# Altium project ECU rev B.PrjPcb (part 1 of 2)
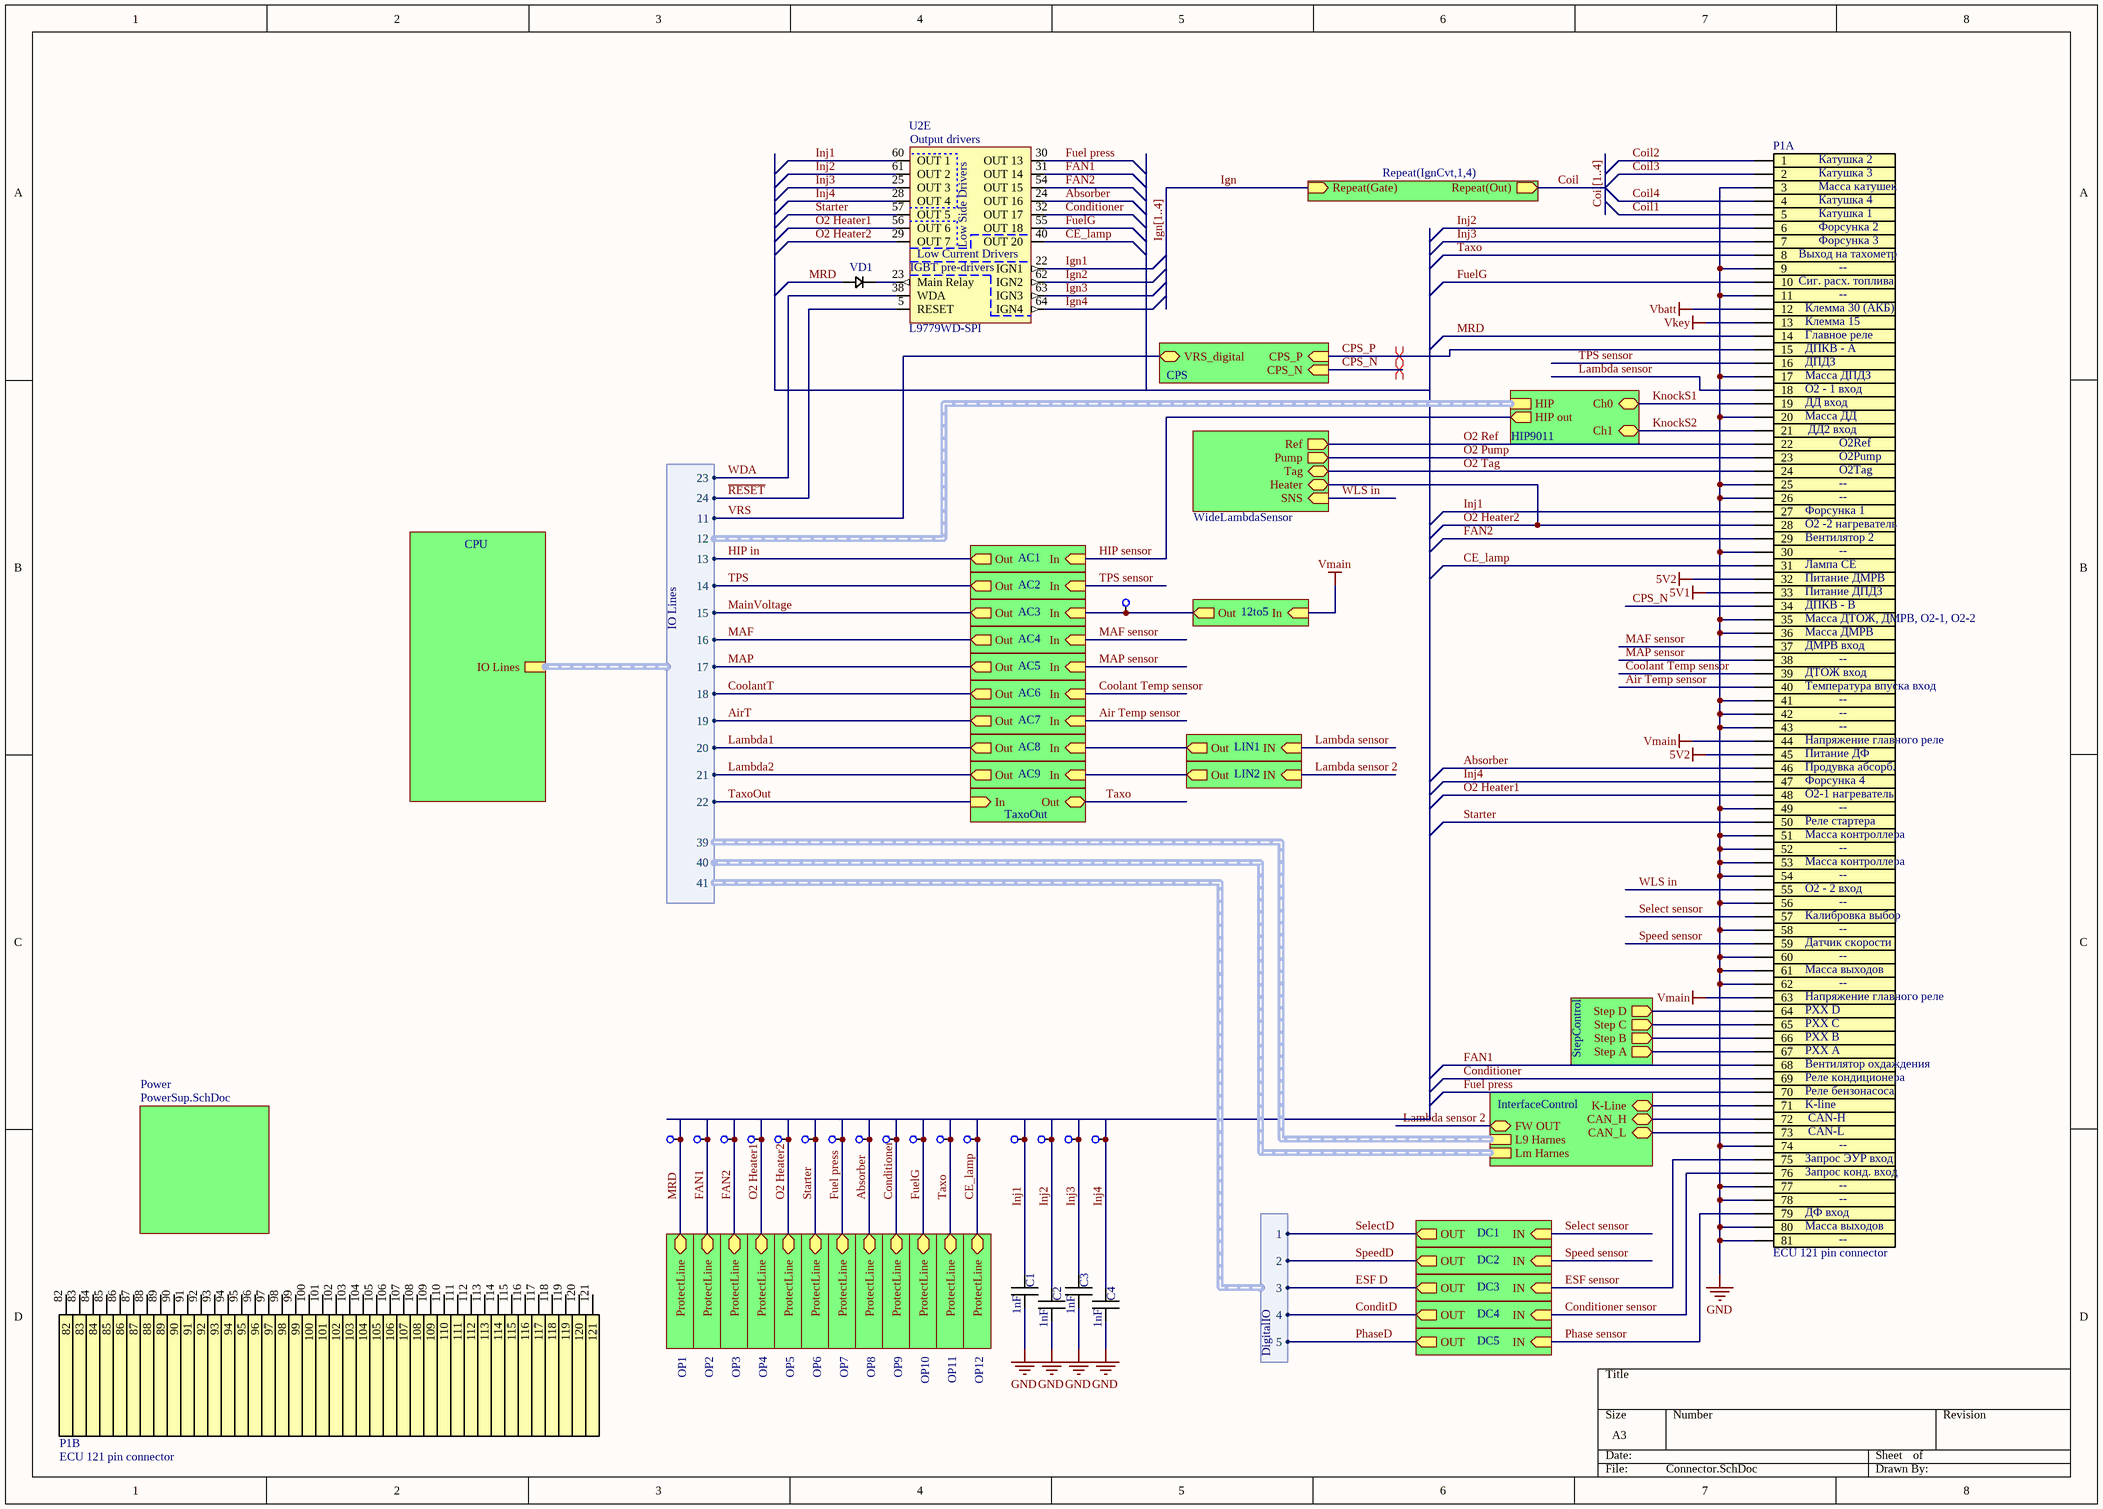
[diagram p0: Connector.SchDoc]
17 sheets, 577 parts. Net scope: hierarchical (ports join the sheet entries above them; power ports are global).
Board file: ECU rev B pcb.PcbDoc
Sheets:
  Connector.SchDoc
    IgnCvt1 = IgnMOSFET.SchDoc
    IgnCvt2 = IgnMOSFET.SchDoc
    IgnCvt3 = IgnMOSFET.SchDoc
    IgnCvt4 = IgnMOSFET.SchDoc
    StepControl = StepDrive.SchDoc
    InterfaceControl = Interface.SchDoc
    OP1 = OutProtect.SchDoc
    OP2 = OutProtect.SchDoc
    OP3 = OutProtect.SchDoc
    OP4 = OutProtect.SchDoc
    OP5 = OutProtect.SchDoc
    OP6 = OutProtect.SchDoc
    OP7 = OutProtect.SchDoc
    OP8 = OutProtect.SchDoc
    OP9 = OutProtect.SchDoc
    OP10 = OutProtect.SchDoc
    OP11 = OutProtect.SchDoc
    OP12 = OutProtect.SchDoc
    Power = PowerSup.SchDoc
    CPS = VRS.SchDoc
    WideLambdaSensor = LambdaWide.SchDoc
    DC1 = DigitalConverter.SchDoc
    DC2 = DigitalConverter.SchDoc
    DC3 = DigitalConverter.SchDoc
    DC4 = DigitalConverter.SchDoc
    DC5 = DigitalConverter.SchDoc
    HIP9011 = HIP9011.SchDoc
    AC1 = AnalogIn.SchDoc
    AC2 = AnalogIn.SchDoc
    AC3 = AnalogIn.SchDoc
    AC4 = AnalogIn.SchDoc
    AC5 = AnalogIn.SchDoc
    AC6 = AnalogIn.SchDoc
    AC7 = AnalogIn.SchDoc
    12to5 = Convert12to5.SchDoc
    AC8 = AnalogIn.SchDoc
    AC9 = AnalogIn.SchDoc
    LIN1 = LambdaIn.SchDoc
    LIN2 = LambdaIn.SchDoc
    TaxoOut = TaxoOut.SchDoc
    CPU = CPU_A.SchDoc
      ExtRam = ExternalRAM.SchDoc
      ExtIO = ExternalIO.SchDoc

## Sheet Connector.SchDoc
size A3

### Parts
C1  1nF  [SMD 0603]
C2  1nF  [SMD 0603]
C3  1nF  [SMD 0603]
C4  1nF  [SMD 0603]
P1  ECU 121 pin connector  [1241434-1]  (parts A,B of 2)  (no BOM)
TP1  TestPoint  [TESTPOINT]  (value not drawn)
TP2  TestPoint  [TESTPOINT]  (value not drawn)
TP3  TestPoint  [TESTPOINT]  (value not drawn)
TP4  TestPoint  [TESTPOINT]  (value not drawn)
TP5  TestPoint  [TESTPOINT]  (value not drawn)
TP6  TestPoint  [TESTPOINT]  (value not drawn)
TP7  TestPoint  [TESTPOINT]  (value not drawn)
TP8  TestPoint  [TESTPOINT]  (value not drawn)
TP9  TestPoint  [TESTPOINT]  (value not drawn)
TP10  TestPoint  [TESTPOINT]  (value not drawn)
TP11  TestPoint  [TESTPOINT]  (value not drawn)
TP12  TestPoint  [TESTPOINT]  (value not drawn)
TP13  TestPoint  [TESTPOINT]  (value not drawn)
TP14  TestPoint  [TESTPOINT]  (value not drawn)
TP15  TestPoint  [TESTPOINT]  (value not drawn)
TP16  TestPoint  [TESTPOINT]  (value not drawn)
TP17  TestPoint  [TESTPOINT]  (value not drawn)
U2  L9779WD-SPI  [HiQUAD-64]  (part E of 6)
VD1  Diode  [DO-214AC]  (value not drawn)

### Sub-sheets
12to5 = Convert12to5.SchDoc: In (in), Out (out)
AC1 = AnalogIn.SchDoc: Out (out), In (in)
AC2 = AnalogIn.SchDoc: Out (out), In (in)
AC3 = AnalogIn.SchDoc: Out (out), In (in)
AC4 = AnalogIn.SchDoc: Out (out), In (in)
AC5 = AnalogIn.SchDoc: Out (out), In (in)
AC6 = AnalogIn.SchDoc: Out (out), In (in)
AC7 = AnalogIn.SchDoc: Out (out), In (in)
AC8 = AnalogIn.SchDoc: Out (out), In (in)
AC9 = AnalogIn.SchDoc: Out (out), In (in)
CPS = VRS.SchDoc: CPS_P (in), VRS_digital (bidir), CPS_N (in)
CPU = CPU_A.SchDoc: IO Lines (harness IO Lines)
DC1 = DigitalConverter.SchDoc: IN (in), OUT (out)
DC2 = DigitalConverter.SchDoc: IN (in), OUT (out)
DC3 = DigitalConverter.SchDoc: IN (in), OUT (out)
DC4 = DigitalConverter.SchDoc: IN (in), OUT (out)
DC5 = DigitalConverter.SchDoc: IN (in), OUT (out)
HIP9011 = HIP9011.SchDoc: HIP (harness HIP), Ch0 (bidir), Ch1 (bidir), HIP out (out)
InterfaceControl = Interface.SchDoc: CAN_L (bidir), CAN_H (bidir), K-Line (bidir), FW OUT (bidir), L9 Harnes (harness L9 Harnes), Lm Harnes (harness Lm Harnes)
LIN1 = LambdaIn.SchDoc: Out (out), IN (in)
LIN2 = LambdaIn.SchDoc: Out (out), IN (in)
OP1 = OutProtect.SchDoc: ProtectLine (bidir)
OP2 = OutProtect.SchDoc: ProtectLine (bidir)
OP3 = OutProtect.SchDoc: ProtectLine (bidir)
OP4 = OutProtect.SchDoc: ProtectLine (bidir)
OP5 = OutProtect.SchDoc: ProtectLine (bidir)
OP6 = OutProtect.SchDoc: ProtectLine (bidir)
OP7 = OutProtect.SchDoc: ProtectLine (bidir)
OP8 = OutProtect.SchDoc: ProtectLine (bidir)
OP9 = OutProtect.SchDoc: ProtectLine (bidir)
OP10 = OutProtect.SchDoc: ProtectLine (bidir)
OP11 = OutProtect.SchDoc: ProtectLine (bidir)
OP12 = OutProtect.SchDoc: ProtectLine (bidir)
Power = PowerSup.SchDoc: no entries
Repeat(IgnCvt,1,4) = IgnMOSFET.SchDoc: Repeat(Gate) (in), Repeat(Out) (out)
StepControl = StepDrive.SchDoc: Step C (out), Step D (out), Step B (out), Step A (out)
TaxoOut = TaxoOut.SchDoc: Out (bidir), In (in)
WideLambdaSensor = LambdaWide.SchDoc: SNS (in), Heater (bidir), Ref (out), Pump (out), Tag (bidir)

### Harnesses
DigitalIO: 1, 2, 3, 4, 5
IO Lines: 11, 12, 13, 14, 15, 16, 17, 18, 19, 20, 21, 22, 23, 24, 39, 40, 41

### Nets
5V1: P1.33
5V2: P1.32 P1.45
GND: C1.1 C2.1 C3.1 C4.1 P1.3 P1.9 P1.11 P1.17 P1.20 P1.25 P1.26 P1.30 P1.35 P1.36 P1.41 P1.42 P1.43 P1.49 P1.51 P1.52 P1.53 P1.54 P1.56 P1.58 P1.60 P1.61 P1.62 P1.74 P1.77 P1.78 P1.80 P1.81
Vbatt: P1.12
Vkey: P1.13
Vmain: P1.44 P1.63 ; sheet 12to5/In
~{RESET}: U2.5(RESET) ; sheet CPU/IO Lines.24
Absorber: P1.46 TP8.0 U2.24(OUT_16) ; sheet OP8/ProtectLine
Air Temp sensor: P1.40 ; sheet AC7/In
AirT: sheet AC7/Out, sheet CPU/IO Lines.19
CAN_H: P1.72 ; sheet InterfaceControl/CAN_H
CAN_L: P1.73 ; sheet InterfaceControl/CAN_L
CE_lamp: P1.31 TP12.0 U2.40(OUT_20) ; sheet OP12/ProtectLine
Coil: sheet Repeat(IgnCvt,1,4)/Repeat(Out)
Coil1: P1.5
Coil2: P1.1
Coil3: P1.2
Coil4: P1.4
ConditD: sheet DC4/OUT, harness DigitalIO.4
Conditioner: P1.69 TP9.0 U2.32(OUT_17) ; sheet OP9/ProtectLine
Conditioner sensor: P1.76 ; sheet DC4/IN
Coolant Temp sensor: P1.39 ; sheet AC6/In
CoolantT: sheet AC6/Out, sheet CPU/IO Lines.18
CPS_N: P1.34 ; sheet CPS/CPS_N
CPS_P: P1.15 ; sheet CPS/CPS_P
ESF D: sheet DC3/OUT, harness DigitalIO.3
ESF sensor: P1.75 ; sheet DC3/IN
FAN1: P1.68 TP2.0 U2.31(OUT_14) ; sheet OP2/ProtectLine
FAN2: P1.29 TP3.0 U2.54(OUT_15) ; sheet OP3/ProtectLine
Fuel press: P1.70 TP7.0 U2.30(OUT_13) ; sheet OP7/ProtectLine
FuelG: P1.10 TP10.0 U2.55(OUT_18) ; sheet OP10/ProtectLine
HIP in: sheet AC1/Out, sheet CPU/IO Lines.13
HIP sensor: sheet HIP9011/HIP out, sheet AC1/In
Ign: sheet Repeat(IgnCvt,1,4)/Repeat(Gate)
Ign1: U2.22(IGN1)
Ign2: U2.62(IGN2)
Ign3: U2.63(IGN3)
Ign4: U2.64(IGN4)
Inj1: C1.2 P1.27 TP13.0 U2.60(OUT_1)
Inj2: C2.2 P1.6 TP14.0 U2.61(OUT_2)
Inj3: C3.2 P1.7 TP15.0 U2.25(OUT_3)
Inj4: C4.2 P1.47 TP16.0 U2.28(OUT_4)
K-line: P1.71 ; sheet InterfaceControl/K-Line
KnockS1: P1.19 ; sheet HIP9011/Ch0
KnockS2: P1.21 ; sheet HIP9011/Ch1
Lambda1: sheet AC8/Out, sheet CPU/IO Lines.20
Lambda2: sheet AC9/Out, sheet CPU/IO Lines.21
Lambda sensor: P1.18 ; sheet LIN1/IN
Lambda sensor 2: sheet InterfaceControl/FW OUT, sheet LIN2/IN
MAF: sheet AC4/Out, sheet CPU/IO Lines.16
MAF sensor: P1.37 ; sheet AC4/In
MainVoltage: sheet AC3/Out, sheet CPU/IO Lines.15
MAP: sheet AC5/Out, sheet CPU/IO Lines.17
MAP sensor: P1.38 ; sheet AC5/In
MRD: P1.14 TP1.0 VD1.0 ; sheet OP1/ProtectLine
O2 Heater1: P1.48 TP4.0 U2.56(OUT_6) ; sheet OP4/ProtectLine
O2 Heater2: P1.28 TP5.0 U2.29(OUT_7) ; sheet OP5/ProtectLine, sheet WideLambdaSensor/Heater
O2 Pump: P1.23 ; sheet WideLambdaSensor/Pump
O2 Ref: P1.22 ; sheet WideLambdaSensor/Ref
O2 Tag: P1.24 ; sheet WideLambdaSensor/Tag
Phase sensor: P1.79 ; sheet DC5/IN
PhaseD: sheet DC5/OUT, harness DigitalIO.5
Select sensor: P1.57 ; sheet DC1/IN
SelectD: sheet DC1/OUT, harness DigitalIO.1
Speed sensor: P1.59 ; sheet DC2/IN
SpeedD: sheet DC2/OUT, harness DigitalIO.2
Starter: P1.50 TP6.0 U2.57(OUT_5) ; sheet OP6/ProtectLine
Step phase A: P1.67 ; sheet StepControl/Step A
Step phase B: P1.66 ; sheet StepControl/Step B
Step phase C: P1.65 ; sheet StepControl/Step C
Step phase D: P1.64 ; sheet StepControl/Step D
Taxo: P1.8 TP11.0 ; sheet OP11/ProtectLine, sheet TaxoOut/Out
TaxoOut: sheet TaxoOut/In, sheet CPU/IO Lines.22
TPS: sheet AC2/Out, sheet CPU/IO Lines.14
TPS sensor: P1.16 ; sheet AC2/In
VRS: sheet CPS/VRS_digital, sheet CPU/IO Lines.11
WDA: U2.38(WDA) ; sheet CPU/IO Lines.23
WLS in: P1.55 ; sheet WideLambdaSensor/SNS
NetC87_AC3_2: TP17.0 ; sheet AC3/In, sheet 12to5/Out
NetC87_AC8_2: sheet AC8/In, sheet LIN1/Out
NetC87_AC9_2: sheet AC9/In, sheet LIN2/Out
NetU2_23: U2.23(Main_Relay) VD1.1

Not connected (* = marked no-connect by the designer): P1 82 83 84 85 86 87 88 89 90 91 92 93 94 95 96 97 98 99 100 101 102 103 104 105 106 107 108 109 110 111 112 113 114 115 116 117 118 119 120 121

### Buses and harness runs
bus Coil[1..4]
bus Ign[1..4]

### Layout directives
differential pair: CPS_N, CPS_P

### Notes on the sheet
- (near P1) Катушка 2
- (near P1) Катушка 3
- (near P1) Катушка 1
- (near P1) Катушка 4
- (near P1) Масса катушек
- (near P1) Форсунка 2
- (near P1) Форсунка 3
- (near P1) Выход на тахометр
- (near P1) Сиг. расх. топлива
- (near P1) Клемма 30 (АКБ)
- --
- (near P1) Клемма 15
- (near P1) Главное реле
- (near P1) ДПКВ - А
- (near P1) Масса ДПДЗ
- (near P1) ДПДЗ
- (near P1) О2 - 1 вход
- (near P1) ДД вход
- (near P1) Масса ДД
- (near P1) ДД2 вход
- O2Ref
- (near P1) Форсунка 1
- O2Pump
- O2Tag
- (near P1) О2 -2 нагреватель
- (near P1) Вентилятор 2
- (near P1) Лампа CE
- (near P1) Питание ДМРВ
- (near P1) Питание ДПДЗ
- (near P1) ДПКВ - В
- (near P1) Масса ДТОЖ, ДМРВ, О2-1, О2-2
- (near P1) Масса ДМРВ
- (near P1) ДМРВ вход
- (near P1) ДТОЖ вход
- (near P1) Температура впуска вход
- (near P1) Форсунка 4
- (near P1) Продувка абсорб.
- (near P1) Питание ДФ
- (near P1) Напряжение главного реле
- (near P1) О2-1 нагреватель
- (near P1) Реле стартера
- (near P1) Масса контроллера
- (near P1) О2 - 2 вход
- (near P1) Калибровка выбор
- (near P1) Датчик скорости
- (near P1) Масса выходов
- (near P1) РХХ А
- (near P1) РХХ B
- (near P1) РХХ C
- (near P1) РХХ D
- (near P1) Вентилятор охдаждения
- (near P1) Реле кондиционера
- (near P1) Реле бензонасоса
- (near P1) K-line
- (near P1) CAN-H
- (near P1) Запрос ЭУР вход
- (near P1) Запрос конд. вход
- (near P1) CAN-L
- (near P1) ДФ вход
- (in symbol L9779WD-SPI, part E) Output drivers; Low Side Drivers; Low Current Drivers; IGBT pre-drivers

### Library data of the parts
C1-C4 = Capasitor: CC0603KRX7R9BB102; Value: 1nF
P1 = 1241434-1
U2 = L9779WD-SPI: Multifunction IC for engine management system
VD1 = Diode: STTH2R02A

## Sheet IgnMOSFET.SchDoc
size A4
Used 4 times, as channels IgnCvt1, IgnCvt2, IgnCvt3, IgnCvt4. Parts and nets are listed once, with the designators drawn on the sheet.
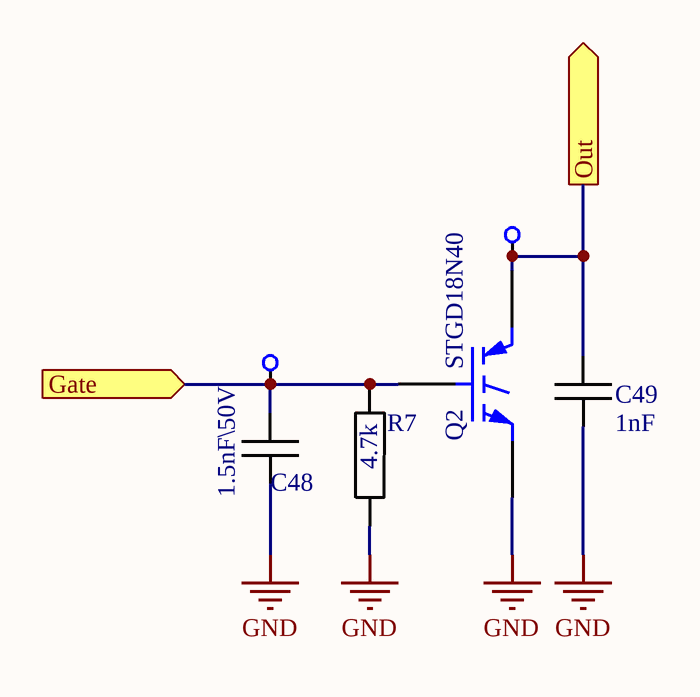
[diagram p1: IgnMOSFET.SchDoc]

### Parts
C48  1.5nF\50V  [SMD 0603]
C49  1nF  [SMD 0603]
Q2  STGD18N40  [DPAK228P991X238-3M]
R7  4.7k  [SMD 0603]
TP29  TestPoint  [TESTPOINT]  (value not drawn)
TP30  TestPoint  [TESTPOINT]  (value not drawn)

### Ports
Gate (in), Out (out)

### Nets
GND: C48.1 C49.1 Q2.3(E) R7.1
Gate: C48.2 Q2.1(G) R7.2 TP29.0 ; port Gate
Out: C49.2 Q2.4(C) TP30.0 ; port Out

### Channels
IgnCvt1: designators end in _IgnCvt1; ports Gate=Ign1 Out=Coil1
IgnCvt2: designators end in _IgnCvt2; ports Gate=Ign2 Out=Coil2
IgnCvt3: designators end in _IgnCvt3; ports Gate=Ign3 Out=Coil3
IgnCvt4: designators end in _IgnCvt4; ports Gate=Ign4 Out=Coil4

### Library data of the parts
C48 = Capasitor: CC0603KRX7R9BB152; Value: 1.5nF\50V
C49 = Capasitor: CC0603KRX7R9BB102; Value: 1nF
Q2 = STGD18N40: IGBT Automotive-grade 390 V internally clamped  ESCIS 180 mJ; ComponentLink1Description: Datasheet; ComponentLink1URL: https://my.st.com/resource/en/datasheet/stgd18n40lz.pdf
R7 = Resistor: RC0603FR-074K7L; Value: 4.7k

## Sheet StepDrive.SchDoc
size A4; Organization: Altium Limited; Address1: L3, 12a Rodborough Rd; Address2: Frenchs Forest; Address3: NSW; Address4: Australia 2086
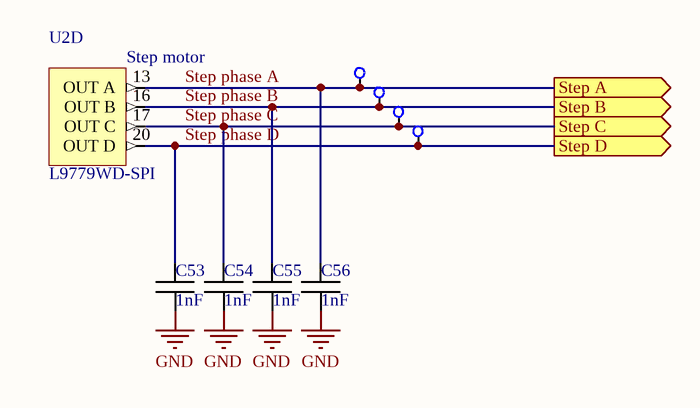
[diagram p2: StepDrive.SchDoc]

### Parts
C53  1nF  [SMD 0603]
C54  1nF  [SMD 0603]
C55  1nF  [SMD 0603]
C56  1nF  [SMD 0603]
TP34  TestPoint  [TESTPOINT]  (value not drawn)
TP35  TestPoint  [TESTPOINT]  (value not drawn)
TP36  TestPoint  [TESTPOINT]  (value not drawn)
TP37  TestPoint  [TESTPOINT]  (value not drawn)
U2  L9779WD-SPI  [HiQUAD-64]  (part D of 6)

### Ports
Step A (out), Step B (out), Step C (out), Step D (out)

### Nets
GND: C53.1 C54.1 C55.1 C56.1
Step phase A: C56.2 TP34.0 U2.13(OUT_A) ; port Step A
Step phase B: C55.2 TP35.0 U2.16(OUT_B) ; port Step B
Step phase C: C54.2 TP36.0 U2.17(OUT_C) ; port Step C
Step phase D: C53.2 TP37.0 U2.20(OUT_D) ; port Step D

### Notes on the sheet
- Title
- Size:
- Date:
- A4
- Number:
- Time:
- Revision:
- Sheet
- of
- File:
- (in symbol L9779WD-SPI, part D) Step motor

### Library data of the parts
C53-C56 = Capasitor: CC0603KRX7R9BB102; Value: 1nF
U2 = L9779WD-SPI: as U2 on sheet Connector

## Sheet Interface.SchDoc
size A4; Organization: Altium Limited; Address1: L3, 12a Rodborough Rd; Address2: Frenchs Forest; Address3: NSW; Address4: Australia 2086
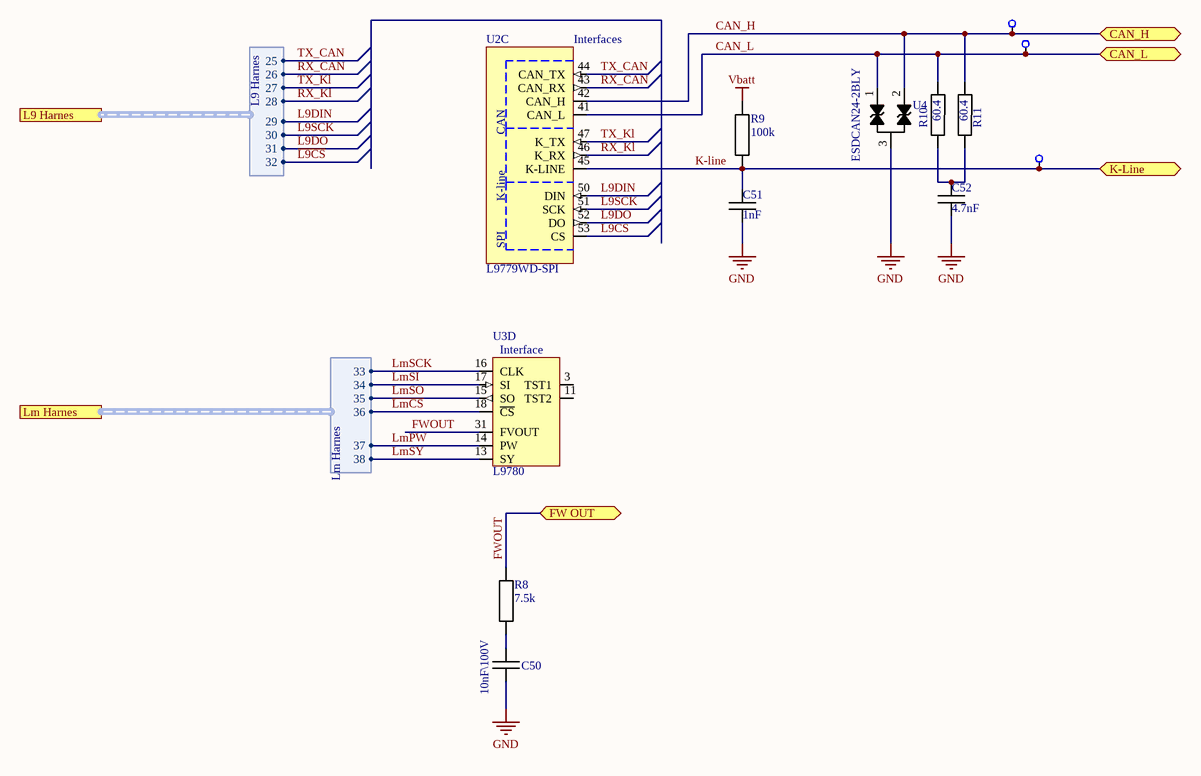
[diagram p3: Interface.SchDoc]

### Parts
C50  10nF\100V  [SMD 0603]
C51  1nF  [SMD 0603]
C52  4.7nF  [SMD 0603]
R8  7.5k  [SMD 0603]
R9  100k  [SMD 0603]
R10  60.4  [SMD 0603]
R11  60.4  [SMD 0603]
TP31  TestPoint  [TESTPOINT]  (value not drawn)
TP32  TestPoint  [TESTPOINT]  (value not drawn)
TP33  TestPoint  [TESTPOINT]  (value not drawn)
U2  L9779WD-SPI  [HiQUAD-64]  (part C of 6)
U3  L9780  [LQFP-48N]  (part D of 4)
U4  ESDCAN24-2BLY  [SOT23]

### Ports
CAN_H (bidir), CAN_L (bidir), FW OUT (bidir), K-Line (bidir), L9 Harnes (harness L9 Harnes), Lm Harnes (harness Lm Harnes)

### Harnesses
L9 Harnes: 25, 26, 27, 28, 29, 30, 31, 32
Lm Harnes: 33, 34, 35, 36, 37, 38

### Nets
GND: C50.1 C51.1 C52.1 U4.3
Vbatt: R9.2
~{L9CS}: U2.53(CS) ; port L9 Harnes.32
~{LmCS}: U3.18(~{CS}) ; port Lm Harnes.36
CAN_H: R11.2 TP31.0 U2.42(CAN_H) U4.2 ; port CAN_H
CAN_L: R10.2 TP32.0 U2.41(CAN_L) U4.1 ; port CAN_L
FWOUT: R8.1 U3.31(FVOUT) ; port FW OUT  [project net Lambda sensor 2]
K-line: C51.2 R9.1 TP33.0 U2.45(K-LINE) ; port K-Line
L9DIN: U2.50(DIN) ; port L9 Harnes.29
L9DO: U2.52(DO) ; port L9 Harnes.31
L9SCK: U2.51(SCK) ; port L9 Harnes.30
LmPW: U3.14(PW) ; port Lm Harnes.37
LmSCK: U3.16(CLK) ; port Lm Harnes.33
LmSI: U3.17(SI) ; port Lm Harnes.34
LmSO: U3.15(SO) ; port Lm Harnes.35
LmSY: U3.13(SY) ; port Lm Harnes.38
RX_CAN: U2.43(CAN_RX) ; port L9 Harnes.26
RX_Kl: U2.46(K_RX) ; port L9 Harnes.28
TX_CAN: U2.44(CAN_TX) ; port L9 Harnes.25
TX_Kl: U2.47(K_TX) ; port L9 Harnes.27
NetC50_2: C50.2 R8.2
NetC52_2: C52.2 R10.1 R11.1

Not connected (* = marked no-connect by the designer): U3 3(TST1) 11(TST2)

### Notes on the sheet
- Title
- Size:
- Date:
- A4
- Number:
- Time:
- Revision:
- Sheet
- of
- File:
- (in symbol L9779WD-SPI, part C) Interfaces; CAN; K-line; SPI
- (in symbol L9780, part D) Interface

### Library data of the parts
C50 = Capasitor: CC0603KRX7R0BB103; Value: 10nF\100V
C51 = Capasitor: CC0603KRX7R9BB102; Value: 1nF
C52 = Capasitor: CC0603KRX7R9BB472; Value: 4.7nF
R8 = Resistor: RC0603FR-077K5L; Value: 7.5k
R9 = Resistor: RT0603BRD07100KL; Value: 100k
R10 R11 = Resistor: RC0603FR-0760R4L; Value: 60.4
U2 = L9779WD-SPI: as U2 on sheet Connector
U3 = L9780: Wide range air fuel sensor control interface
U4 = ESDCANxx-2BLY

## Sheet OutProtect.SchDoc
size A4; Organization: Altium Limited; Address1: L3, 12a Rodborough Rd; Address2: Frenchs Forest; Address3: NSW; Address4: Australia 2086
Used 12 times, as channels OP1, OP2, OP3, OP4, OP5, OP6, OP7, OP8, OP9, OP10, OP11, OP12. Parts and nets are listed once, with the designators drawn on the sheet.
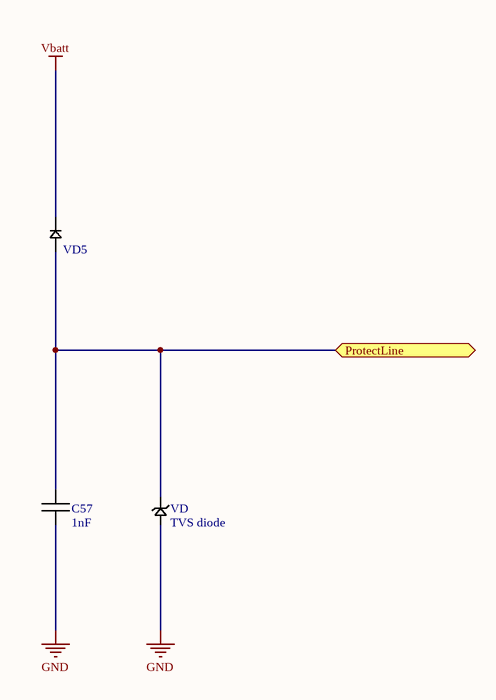
[diagram p4: OutProtect.SchDoc]

### Parts
C57  1nF  [SMD 0603]
VD  TVS diode  [SOD323]
VD5  Diode  [SOD323]  (value not drawn)

### Ports
ProtectLine (bidir)

### Nets
GND: C57.1 VD.2
Vbatt: VD5.1
ProtectLine: C57.2 VD.1 VD5.0 ; port ProtectLine

### Channels
OP1: designators end in _OP1; ports ProtectLine=MRD
OP2: designators end in _OP2; ports ProtectLine=FAN1
OP3: designators end in _OP3; ports ProtectLine=FAN2
OP4: designators end in _OP4; ports ProtectLine=O2 Heater1
OP5: designators end in _OP5; ports ProtectLine=O2 Heater2
OP6: designators end in _OP6; ports ProtectLine=Starter
OP7: designators end in _OP7; ports ProtectLine=Fuel press
OP8: designators end in _OP8; ports ProtectLine=Absorber
OP9: designators end in _OP9; ports ProtectLine=Conditioner
OP10: designators end in _OP10; ports ProtectLine=FuelG
OP11: designators end in _OP11; ports ProtectLine=Taxo
OP12: designators end in _OP12; ports ProtectLine=CE_lamp

### Notes on the sheet
- Title
- Size:
- Date:
- A4
- Number:
- Time:
- Revision:
- Sheet
- of
- File:

### Library data of the parts
C57 = Capasitor: CC0603KRX7R9BB102; Value: 1nF
VD = TVS diode: CDSOD323-T18LC
VD5 = Diode: PMEG2020EJ.115; pin to pad: 0>2

## Sheet PowerSup.SchDoc
size A3
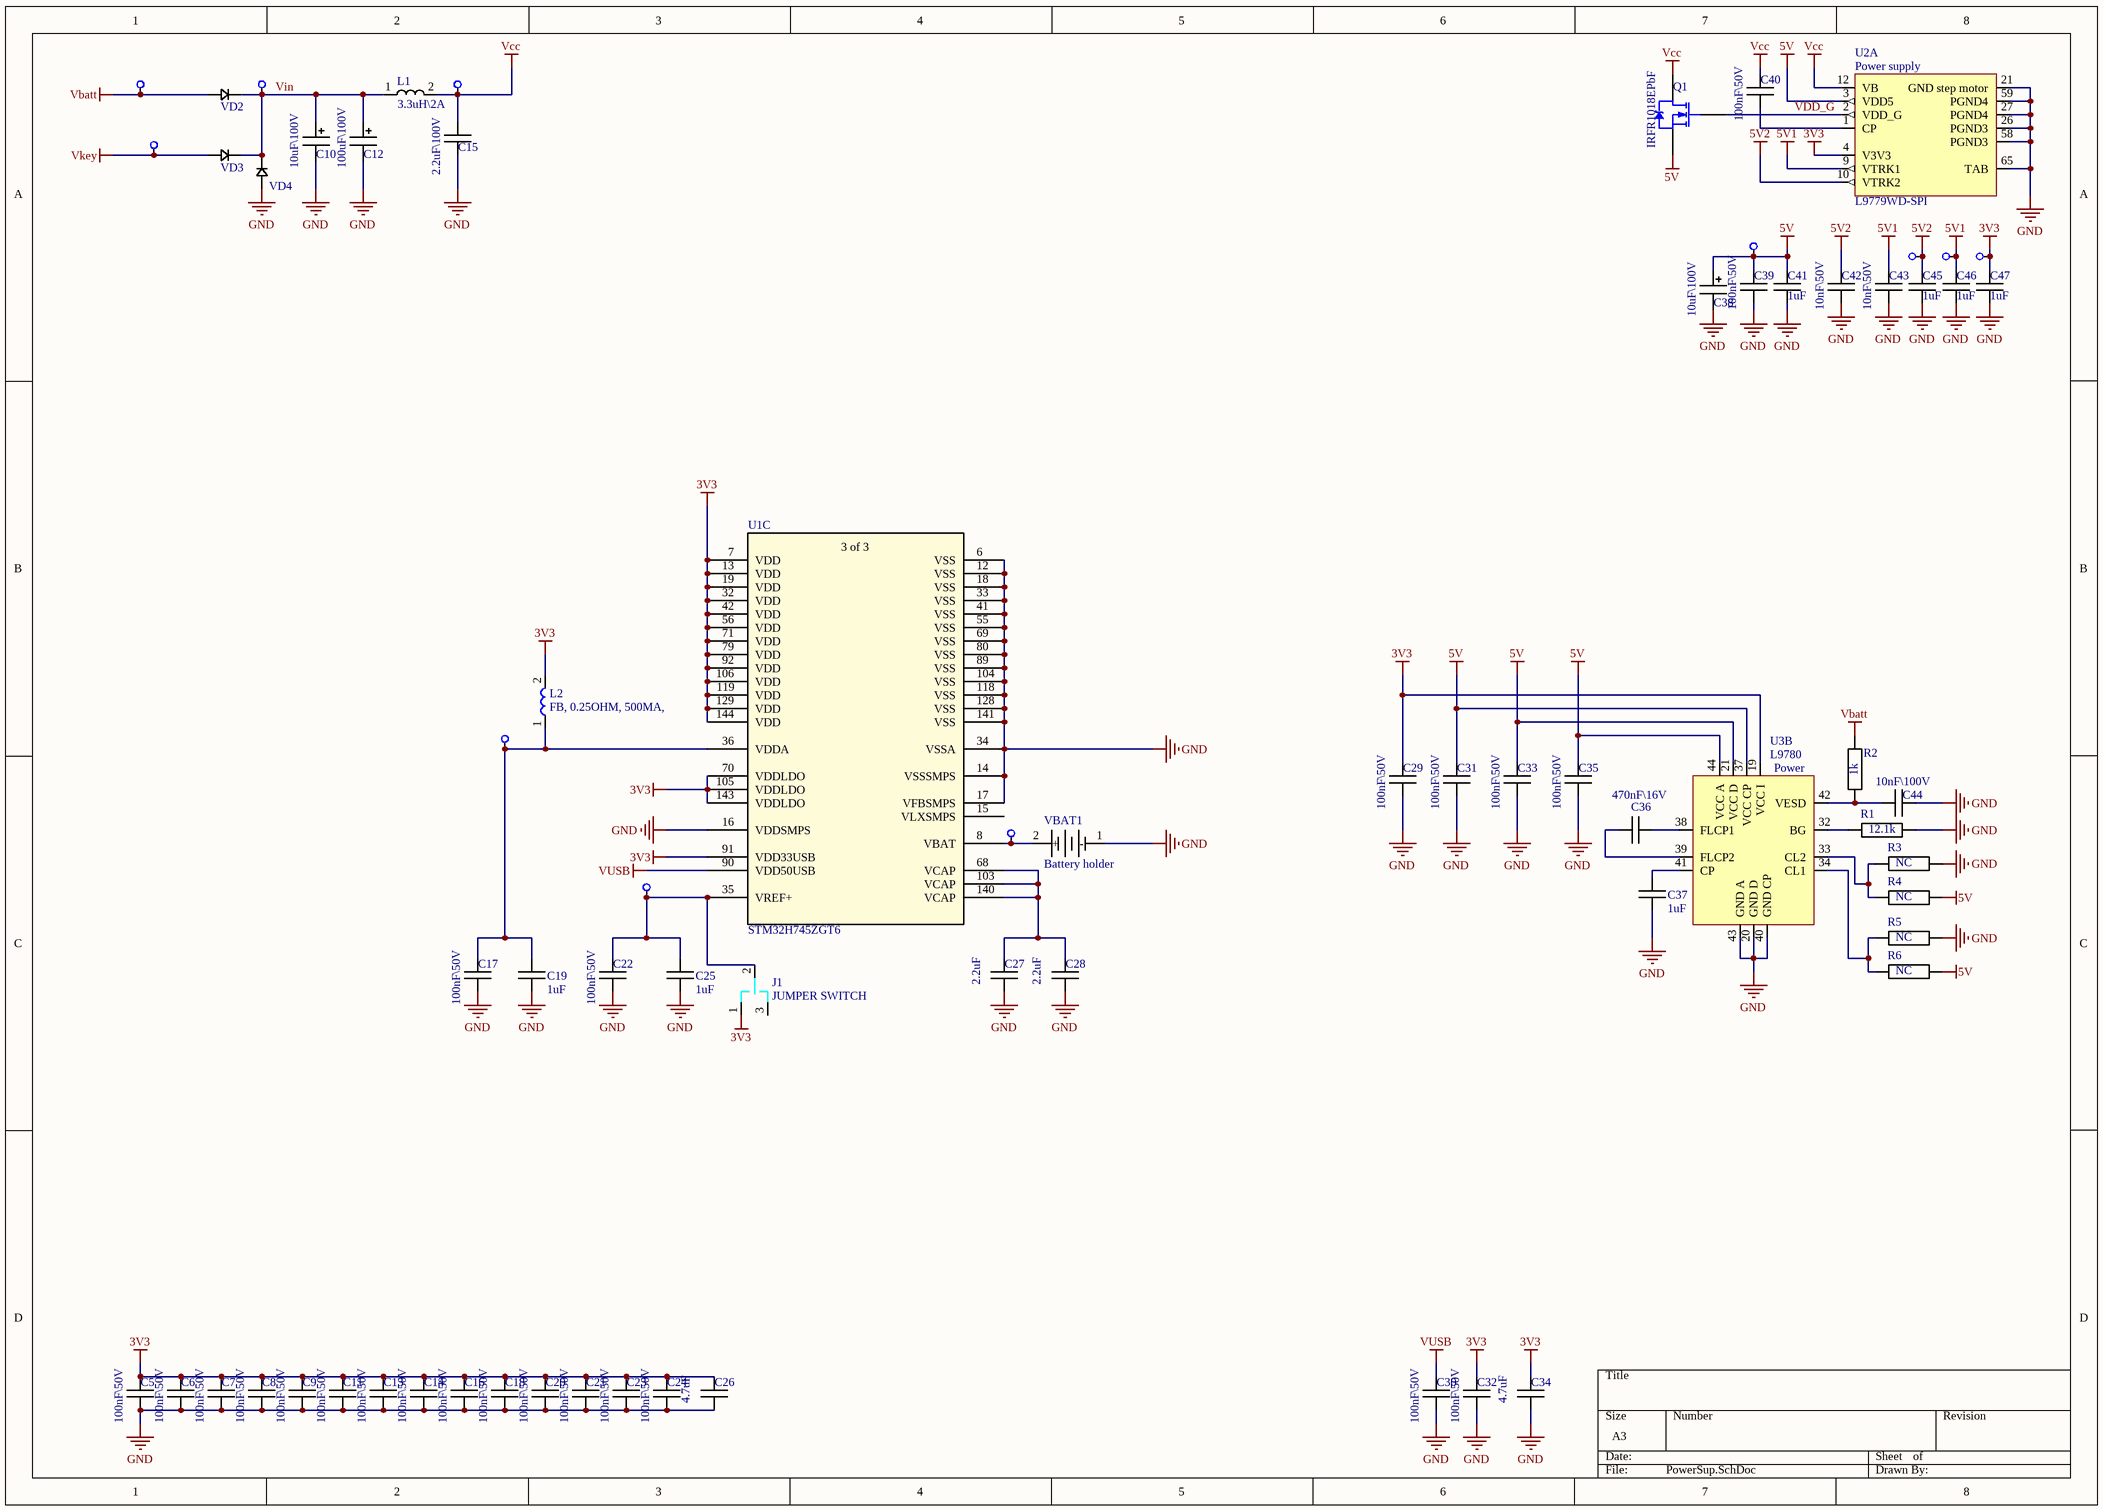
[diagram p5: PowerSup.SchDoc]

### Parts
C5  100nF\50V  [SMD 0603]
C6  100nF\50V  [SMD 0603]
C7  100nF\50V  [SMD 0603]
C8  100nF\50V  [SMD 0603]
C9  100nF\50V  [SMD 0603]
C10  10uF\100V  [CAP 5x11]
C11  100nF\50V  [SMD 0603]
C12  100uF\100V  [CAP 10x20]
C13  100nF\50V  [SMD 0603]
C14  100nF\50V  [SMD 0603]
C15  2.2uF\100V  [SMD 1206]
C16  100nF\50V  [SMD 0603]
C17  100nF\50V  [SMD 0603]
C18  100nF\50V  [SMD 0603]
C19  1uF  [SMD 0603]
C20  100nF\50V  [SMD 0603]
C21  100nF\50V  [SMD 0603]
C22  100nF\50V  [SMD 0603]
C23  100nF\50V  [SMD 0603]
C24  100nF\50V  [SMD 0603]
C25  1uF  [SMD 0603]
C26  4.7uF  [SMD 0603]
C27  2.2uF  [SMD 0603]
C28  2.2uF  [SMD 0603]
C29  100nF\50V  [SMD 0603]
C30  100nF\50V  [SMD 0603]
C31  100nF\50V  [SMD 0603]
C32  100nF\50V  [SMD 0603]
C33  100nF\50V  [SMD 0603]
C34  4.7uF  [SMD 0603]
C35  100nF\50V  [SMD 0603]
C36  470nF\16V  [SMD 0603]
C37  1uF  [SMD 0603]
C38  10uF\100V  [CAP 5x11]
C39  100nF\50V  [SMD 0603]
C40  100nF\50V  [SMD 0603]
C41  1uF  [SMD 0603]
C42  10nF\50V  [SMD 0603]
C43  10nF\50V  [SMD 0603]
C44  10nF\100V  [SMD 0603]
C45  1uF  [SMD 0603]
C46  1uF  [SMD 0603]
C47  1uF  [SMD 0603]
J1  JUMPER SWITCH  [JMP3]
L1  3.3uH\2A  [SDR0604]
L2  FB, 0.25OHM, 500MA,  [SMD 0805]
Q1  IRFR1018EPbF  [DPAK228P991X238-3M]
R1  12.1k  [SMD 0603]
R2  1k  [SMD 0603]
R3  NC  [SMD 0603]
R4  NC  [SMD 0603]
R5  NC  [SMD 0603]
R6  NC  [SMD 0603]
TP18  TestPoint  [TESTPOINT]  (value not drawn)
TP19  TestPoint  [TESTPOINT]  (value not drawn)
TP20  TestPoint  [TESTPOINT]  (value not drawn)
TP21  TestPoint  [TESTPOINT]  (value not drawn)
TP22  TestPoint  [TESTPOINT]  (value not drawn)
TP23  TestPoint  [TESTPOINT]  (value not drawn)
TP24  TestPoint  [TESTPOINT]  (value not drawn)
TP25  TestPoint  [TESTPOINT]  (value not drawn)
TP26  TestPoint  [TESTPOINT]  (value not drawn)
TP27  TestPoint  [TESTPOINT]  (value not drawn)
TP28  TestPoint  [TESTPOINT]  (value not drawn)
U1  STM32H745ZGT6  [LQFP-144]  (part C of 3)
U2  L9779WD-SPI  [HiQUAD-64]  (part A of 6)
U3  L9780  [LQFP-48N]  (part B of 4)
VBAT1  Battery holder  [796136-1]
VD2  Diode  [DO-214AA]  (value not drawn)
VD3  Diode  [DO-214AA]  (value not drawn)
VD4  Diode  [DO-214AB]  (value not drawn)

### Nets
3V3: C5.2 C6.2 C7.2 C8.2 C9.2 C11.2 C13.2 C14.2 C16.2 C18.2 C20.2 C21.2 C23.2 C24.2 C26.2 C29.2 C32.2 C34.2 C47.2 J1.1 L2.2 TP28.0 U1.7(VDD) U1.13(VDD) U1.19(VDD) U1.32(VDD) U1.42(VDD) U1.56(VDD) U1.70(VDDLDO) U1.71(VDD) U1.79(VDD) U1.91(VDD33USB) U1.92(VDD) U1.105(VDDLDO) U1.106(VDD) U1.119(VDD) U1.129(VDD) U1.143(VDDLDO) U1.144(VDD) U2.4(V3V3) U3.19(VCC_I)
5V: C31.2 C33.2 C35.2 C38.1 C39.2 C41.2 Q1.3(S) R4.2 R6.2 TP25.0 U2.3(VDD5) U3.21(VCC_D) U3.37(VCC_CP) U3.44(VCC_A)
5V1: C43.2 C46.2 TP27.0 U2.9(VTRK1)
5V2: C42.2 C45.2 TP26.0 U2.10(VTRK2)
GND: C5.1 C6.1 C7.1 C8.1 C9.1 C10.0 C11.1 C12.0 C13.1 C14.1 C15.1 C16.1 C17.1 C18.1 C19.2 C20.1 C21.1 C22.1 C23.1 C24.1 C25.2 C26.1 C27.1 C28.1 C29.1 C30.1 C31.1 C32.1 C33.1 C34.1 C35.1 C37.2 C38.0 C39.1 C41.1 C42.1 C43.1 C44.1 C45.1 C46.1 C47.1 R1.1 R3.1 R5.1 U1.6(VSS) U1.12(VSS) U1.14(VSSSMPS) U1.16(VDDSMPS) U1.17(VFBSMPS) U1.18(VSS) U1.33(VSS) U1.34(VSSA) U1.41(VSS) U1.55(VSS) U1.69(VSS) U1.80(VSS) U1.89(VSS) U1.104(VSS) U1.118(VSS) U1.128(VSS) U1.141(VSS) U2.21(GND_step_motor) U2.26(PGND3) U2.27(PGND4) U2.58(PGND3) U2.59(PGND4) U2.65(TAB) U3.20(GND_D) U3.40(GND_CP) U3.43(GND_A) VBAT1.1(-) VD4.0
Vbatt: R2.2 TP18.0 VD2.0
Vcc: C15.2 C40.2 L1.2 Q1.4(D) TP21.0 U2.12(VB)
Vkey: TP19.0 VD3.0
VUSB: C30.2 U1.90(VDD50USB)
VDD_G: Q1.1(G) U2.2(VDD_G)
Vin: C10.1 C12.1 L1.1 TP20.0 VD2.1 VD3.1 VD4.1
NetC17_2: C17.2 C19.1 L2.1 TP22.0 U1.36(VDDA)
NetC22_2: C22.2 C25.1 J1.2 TP23.0 U1.35(VREF+)
NetC27_2: C27.2 C28.2 U1.68(VCAP) U1.103(VCAP) U1.140(VCAP)
NetC36_1: C36.1 U3.38(FLCP1)
NetC36_2: C36.2 U3.39(FLCP2)
NetC37_1: C37.1 U3.41(CP)
NetC40_1: C40.1 U2.1(CP)
NetC44_2: C44.2 R2.1 U3.42(VESD)
NetR1_2: R1.2 U3.32(BG)
NetR3_2: R3.2 R4.1 U3.33(CL2)
NetR5_2: R5.2 R6.1 U3.34(CL1)
NetTP24_0: TP24.0 U1.8(VBAT) VBAT1.2(+)

Not connected (* = marked no-connect by the designer): J1 3; U1 15(VLXSMPS)

### Notes on the sheet
- (in symbol L9779WD-SPI, part A) Power supply
- (in symbol L9780, part B) Power
- (in symbol STM32H745ZGT6, part C) 3 of 3

### Library data of the parts
C5-C9 C11 C13 C14 C16-C18 C20-C24 C29-C33 C35 C39 C40 = Capasitor: CC0603KRX7R9BB104; Value: 100nF\50V
C10 C38 = Capasitor polar: SH100M0010BZF-0611; Value: 10uF\100V
C12 = Capasitor polar: SK100M0100B5S-1019; Value: 100uF\100V
C15 = Capasitor: GRM31CR72A225KA73L; Value: 2.2uF\100V
C19 C25 C37 C41 C45-C47 = Capasitor: CL10A105KB8NNNC; Value: 1uF
C26 C34 = Capasitor: CC0603KRX5R6BB475; Value: 4.7uF
C27 C28 = Capasitor: CC0603KRX5R6BB225; Value: 2.2uF
C36 = Capasitor: CC0603KRX7R7BB474; Value: 470nF\16V
C42 C43 = Capasitor: CC0603JRX7R9BB103; Value: 10nF\50V
C44 = Capasitor: CC0603KRX7R0BB103; Value: 10nF\100V
L1 = Inductor: SDR0604-3R3ML; Value: 3.3uH\2A
L2 = Inductor: BK2125HM601-T; Value: FB, 0.25OHM, 500MA,
Q1 = IRFR1018EPbF: HEXFET Power MOSFET; ComponentLink1Description: datasheet; ComponentLink1URL: https://data.electronshik.ru/z/Datasheet/I/IRFR1018EPBF.pdf
R1 = Resistor: RC0603FR-0712K1L; Value: 12.1k
R2 = Resistor: RC0603FR-071KL; Value: 1k
R3-R6 = Resistor: Value: NC
U1 = STM32H745ZGT6: No Description Available; Vendor: STMicroelectronics; Built_By: EMA_UL_Team; SourceLibrary: Updates_to_database_2020-10-19; Manufacturer_Part_Number: STM32H745ZGT6; Copyright: Copyright (C) 2018 Accelerated Designs. All rights reserved; RefDes: RefDes; Type: DEV
U2 = L9779WD-SPI: as U2 on sheet Connector
U3 = L9780: as U3 on sheet Interface
VBAT1 = Battery holder: Battery Holders, Battery Compatibility CR2032, Board-to-Board, 2 Position, Horizontal PCB Mount Orientation
VD2 = Diode: STTH4R02U
VD3 = Diode: STTH4R02U 200 V, 4 A High Effiency Ultrafast Diode; ComponentLink1Description: Datashit; ComponentLink1URL: https://www.st.com/resource/en/datasheet/stth4r02.pdf
VD4 = Diode: 5.0SMDJ30CA

## Sheet VRS.SchDoc
size A4; Organization: Altium Limited; Address1: L3, 12a Rodborough Rd; Address2: Frenchs Forest; Address3: NSW; Address4: Australia 2086
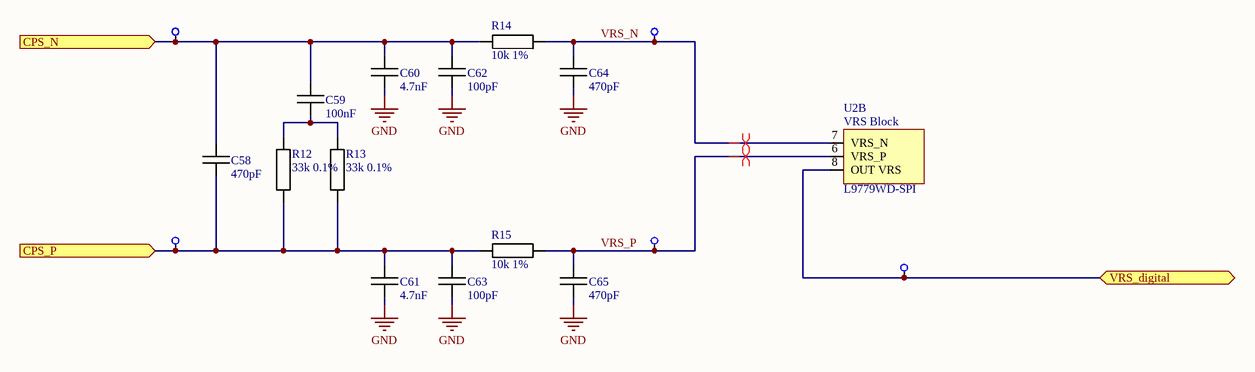
[diagram p6: VRS.SchDoc]

### Parts
C58  470pF  [SMD 0603]
C59  100nF  [SMD 0603]
C60  4.7nF  [SMD 0603]
C61  4.7nF  [SMD 0603]
C62  100pF  [SMD 0603]
C63  100pF  [SMD 0603]
C64  470pF  [SMD 0603]
C65  470pF  [SMD 0603]
R12  33k 0.1%  [SMD 0603]
R13  33k 0.1%  [SMD 0603]
R14  10k 1%  [SMD 0603]
R15  10k 1%  [SMD 0603]
TP38  TestPoint  [TESTPOINT]  (value not drawn)
TP39  TestPoint  [TESTPOINT]  (value not drawn)
TP40  TestPoint  [TESTPOINT]  (value not drawn)
TP41  TestPoint  [TESTPOINT]  (value not drawn)
TP42  TestPoint  [TESTPOINT]  (value not drawn)
U2  L9779WD-SPI  [HiQUAD-64]  (part B of 6)

### Ports
CPS_N (in), CPS_P (in), VRS_digital (bidir)

### Nets
GND: C60.1 C61.1 C62.1 C63.1 C64.1 C65.1
CPS_N: C58.2 C59.1 C60.2 C62.2 R14.1 TP38.0 ; port CPS_N
CPS_P: C58.1 C61.2 C63.2 R12.2 R13.2 R15.1 TP39.0 ; port CPS_P
VRS: TP42.0 U2.8(OUT_VRS) ; port VRS_digital
VRS_N: C64.2 R14.2 TP40.0 U2.7(VRS_N)
VRS_P: C65.2 R15.2 TP41.0 U2.6(VRS_P)
NetC59_2: C59.2 R12.1 R13.1

### Layout directives
differential pair: VRS_N, VRS_P

### Notes on the sheet
- Title
- Size:
- Date:
- A4
- Number:
- Time:
- Revision:
- Sheet
- of
- File:
- (in symbol L9779WD-SPI, part B) VRS Block

### Library data of the parts
C58 C64 C65 = Capasitor: CC0603KRX7R9BB471; Value: 470pF
C59 = Capasitor: CC0603KRX7R9BB104; Value: 100nF
C60 C61 = Capasitor: CC0603KRX7R9BB472; Value: 4.7nF
C62 C63 = Capasitor: CC0603KRX7R9BB101; Value: 100pF
R12 R13 = Resistor: RT0603BRD0733KL; Value: 33k 0.1%
R14 R15 = Resistor: RT0603FRE0710KL; Value: 10k 1%
U2 = L9779WD-SPI: as U2 on sheet Connector

## Sheet LambdaWide.SchDoc
size A4; Organization: Altium Limited; Address1: L3, 12a Rodborough Rd; Address2: Frenchs Forest; Address3: NSW; Address4: Australia 2086
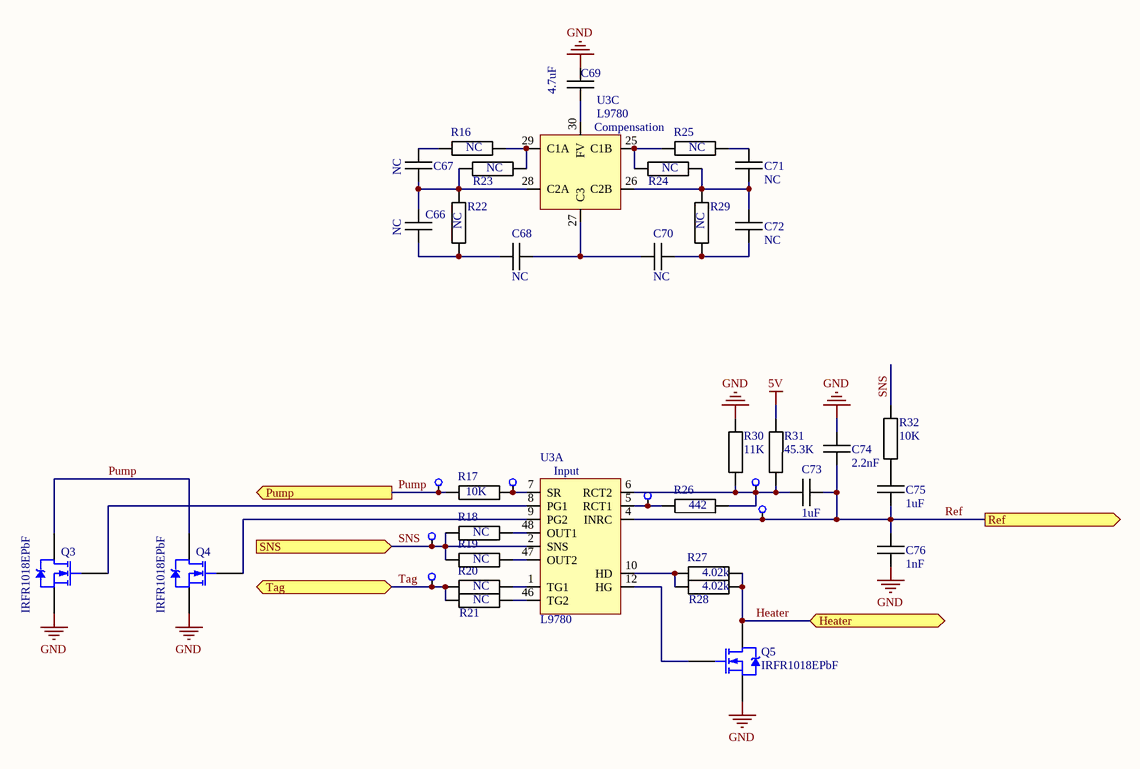
[diagram p7: LambdaWide.SchDoc]

### Parts
C66  NC  [SMD 0603]
C67  NC  [SMD 0603]
C68  NC  [SMD 0603]
C69  4.7uF  [SMD 0603]
C70  NC  [SMD 0603]
C71  NC  [SMD 0603]
C72  NC  [SMD 0603]
C73  1uF  [SMD 0603]
C74  2.2nF  [SMD 0603]
C75  1uF  [SMD 0603]
C76  1nF  [SMD 0603]
Q3  IRFR1018EPbF  [DPAK228P991X238-3M]
Q4  IRFR1018EPbF  [DPAK228P991X238-3M]
Q5  IRFR1018EPbF  [DPAK228P991X238-3M]
R16  NC  [SMD 0603]
R17  10K  [SMD 0603]
R18  NC  [SMD 0603]
R19  NC  [SMD 0603]
R20  NC  [SMD 0603]
R21  NC  [SMD 0603]
R22  NC  [SMD 0603]
R23  NC  [SMD 0603]
R24  NC  [SMD 0603]
R25  NC  [SMD 0603]
R26  442  [SMD 0603]
R27  4.02k  [SMD 0603]
R28  4.02k  [SMD 0603]
R29  NC  [SMD 0603]
R30  11K  [SMD 0603]
R31  45.3K  [SMD 0603]
R32  10K  [SMD 0603]
TP43  TestPoint  [TESTPOINT]  (value not drawn)
TP44  TestPoint  [TESTPOINT]  (value not drawn)
TP45  TestPoint  [TESTPOINT]  (value not drawn)
TP46  TestPoint  [TESTPOINT]  (value not drawn)
TP47  TestPoint  [TESTPOINT]  (value not drawn)
TP48  TestPoint  [TESTPOINT]  (value not drawn)
TP49  TestPoint  [TESTPOINT]  (value not drawn)
U3  L9780  [LQFP-48N]  (parts A,C of 4)

### Ports
Heater (bidir), Pump (out), Ref (out), SNS (in), Tag (bidir)

### Nets
5V: R31.2
GND: C69.2 C74.2 C76.1 Q3.3(S) Q4.3(S) Q5.3(S) R30.1
Heater: Q5.4(D) R27.1 R28.1 ; port Heater  [project net O2 Heater2]
Pump: Q3.4(D) Q4.4(D) R17.2 TP45.0 ; port Pump  [project net O2 Pump]
Ref: C73.2 C74.1 C75.2 C76.2 TP49.0 U3.4(INRC) ; port Ref  [project net O2 Ref]
SNS: R18.2 R19.2 R32.2 TP43.0 U3.2(SNS) ; port SNS  [project net WLS in]
Tag: R20.2 R21.2 TP44.0 ; port Tag  [project net O2 Tag]
NetC66_1: C66.1 C67.2 R22.1 R23.1 U3.28(C2A)
NetC66_2: C66.2 C68.2 R22.2
NetC67_1: C67.1 R16.1
NetC68_1: C68.1 C70.2 U3.27(C3)
NetC69_1: C69.1 U3.30(FV)
NetC70_1: C70.1 C72.2 R29.2
NetC71_1: C71.1 R25.1
NetC71_2: C71.2 C72.1 R24.1 R29.1 U3.26(C2B)
NetC73_1: C73.1 R26.2 R30.2 R31.1 TP48.0 U3.6(RCT2)
NetC75_1: C75.1 R32.1
NetQ3_1: Q3.1(G) U3.8(PG1)
NetQ4_1: Q4.1(G) U3.9(PG2)
NetQ5_1: Q5.1(G) U3.12(HG)
NetR16_2: R16.2 R23.2 U3.29(C1A)
NetR17_1: R17.1 TP46.0 U3.7(SR)
NetR18_1: R18.1 U3.48(OUT1)
NetR19_1: R19.1 U3.47(OUT2)
NetR20_1: R20.1 U3.1(TG1)
NetR21_1: R21.1 U3.46(TG2)
NetR24_2: R24.2 R25.2 U3.25(C1B)
NetR26_1: R26.1 TP47.0 U3.5(RCT1)
NetR27_2: R27.2 R28.2 U3.10(HD)

### Notes on the sheet
- Title
- Size:
- Date:
- A4
- Number:
- Time:
- Revision:
- Sheet
- of
- File:
- (in symbol L9780, part A) Input
- (in symbol L9780, part C) Compensation

### Library data of the parts
C66-C68 C70-C72 = Capasitor: Value: NC
C69 = Capasitor: CC0603KRX5R6BB475; Value: 4.7uF
C73 C75 = Capasitor: CL10A105KB8NNNC; Value: 1uF
C74 = Capasitor: CC0603KRX7R9BB222; Value: 2.2nF
C76 = Capasitor: CC0603KRX7R9BB102; Value: 1nF
Q3-Q5 = IRFR1018EPbF: HEXFET Power MOSFET; ComponentLink1Description: datasheet; ComponentLink1URL: https://data.electronshik.ru/z/Datasheet/I/IRFR1018EPBF.pdf
R16 R18-R25 R29 = Resistor: Value: NC
R17 R32 = Resistor: RC0603FR-0710KL; Value: 10K
R26 = Resistor: RC0603FR-07442RL; Value: 442
R27 R28 = Resistor: RC0603FR-074K02L; Value: 4.02k
R30 = Resistor: RC0603FR-0711KL; Value: 11K
R31 = Resistor: RC0603FR-0745K3L; Value: 45.3K
U3 = L9780: as U3 on sheet Interface

## Sheet DigitalConverter.SchDoc
size A4; Organization: Altium Limited; Address1: L3, 12a Rodborough Rd; Address2: Frenchs Forest; Address3: NSW; Address4: Australia 2086
Used 5 times, as channels DC1, DC2, DC3, DC4, DC5. Parts and nets are listed once, with the designators drawn on the sheet.
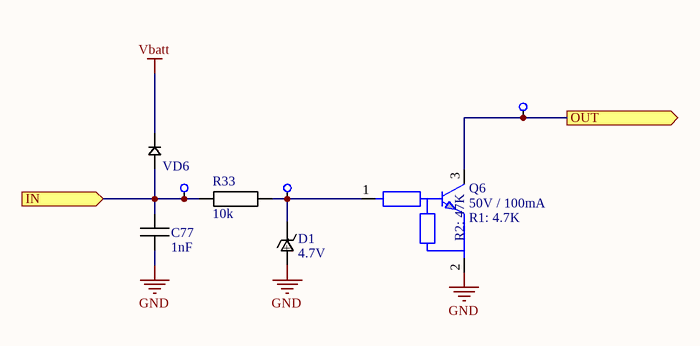
[diagram p8: DigitalConverter.SchDoc]

### Parts
C77  1nF  [SMD 0603]
D1  4.7V  [SOD323]
Q6  50V / 100mA  R1: 4.7K  R2: 47K  [SOT23]
R33  10k  [SMD 0603]
TP50  TestPoint  [TESTPOINT]  (value not drawn)
TP51  TestPoint  [TESTPOINT]  (value not drawn)
TP52  TestPoint  [TESTPOINT]  (value not drawn)
VD6  Diode  [SOD323]  (value not drawn)

### Ports
IN (in), OUT (out)

### Nets
GND: C77.1 D1.- Q6.2(E)
Vbatt: VD6.1
IN: C77.2 R33.1 TP50.0 VD6.0 ; port IN
OUT: Q6.3(C) TP52.0 ; port OUT
NetD1_+: D1.+ Q6.1(B) R33.2 TP51.0

### Channels
DC1: designators end in _DC1; ports IN=Select sensor OUT=SelectD
DC2: designators end in _DC2; ports IN=Speed sensor OUT=SpeedD
DC3: designators end in _DC3; ports IN=ESF sensor OUT=ESF D
DC4: designators end in _DC4; ports IN=Conditioner sensor OUT=ConditD
DC5: designators end in _DC5; ports IN=Phase sensor OUT=PhaseD

### Notes on the sheet
- Title
- Size:
- Date:
- A4
- Number:
- Time:
- Revision:
- Sheet
- of
- File:

### Library data of the parts
C77 = Capasitor: CC0603KRX7R9BB102; Value: 1nF
D1 = Zener: BZX384-C4V7.115; pin to pad: +>1 ->2; value: 4.7V
Q6 = PDTC143ZT: NPN
R33 = Resistor: RC0603FR-0710KL; Value: 10k
VD6 = Diode: PMEG2020EJ.115; pin to pad: 0>2

## Sheet HIP9011.SchDoc
size A4; Organization: Altium Limited; Address1: L3, 12a Rodborough Rd; Address2: Frenchs Forest; Address3: NSW; Address4: Australia 2086
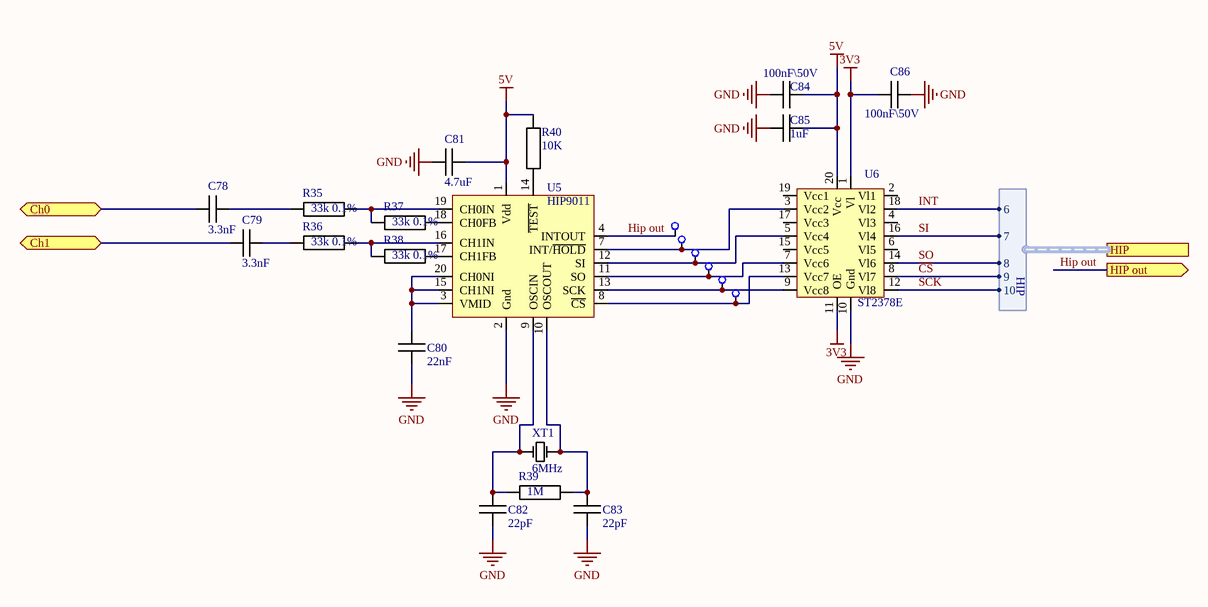
[diagram p9: HIP9011.SchDoc]

### Parts
C78  3.3nF  [SMD 0603]
C79  3.3nF  [SMD 0603]
C80  22nF  [SMD 0603]
C81  4.7uF  [SMD 0603]
C82  22pF  [SMD 0603]
C83  22pF  [SMD 0603]
C84  100nF\50V  [SMD 0603]
C85  1uF  [SMD 0603]
C86  100nF\50V  [SMD 0603]
R35  33k 0.1%  [SMD 0603]
R36  33k 0.1%  [SMD 0603]
R37  33k 0.1%  [SMD 0603]
R38  33k 0.1%  [SMD 0603]
R39  1M  [SMD 0603]
R40  10K  [SMD 0603]
TP53  TestPoint  [TESTPOINT]  (value not drawn)
TP54  TestPoint  [TESTPOINT]  (value not drawn)
TP55  TestPoint  [TESTPOINT]  (value not drawn)
TP56  TestPoint  [TESTPOINT]  (value not drawn)
TP57  TestPoint  [TESTPOINT]  (value not drawn)
TP58  TestPoint  [TESTPOINT]  (value not drawn)
U5  HIP9011  [SOIC20]
U6  ST2378E  [TSSOP20]
XT1  6MHz  [KX-13]

### Ports
Ch0 (bidir), Ch1 (bidir), HIP (harness HIP), HIP out (out)

### Harnesses
HIP: 6, 7, 8, 9, 10

### Nets
3V3: C86.1 U6.1(Vl) U6.11(OE)
5V: C81.2 C84.1 C85.1 R40.1 U5.1(Vdd) U6.20(Vcc)
GND: C80.1 C81.1 C82.1 C83.1 C84.2 C85.2 C86.2 U5.2(Gnd) U6.10(Gnd) XT1.3
~{CS}: U6.8(Vl7) ; port HIP.9
Hip out: TP53.0 U5.4(INTOUT) ; port HIP out  [project net HIP sensor]
INT: U6.18(Vl2) ; port HIP.6  [project net HIP INT]
KnockS1: C78.2 ; port Ch0
KnockS2: C79.2 ; port Ch1
SCK: U6.12(Vl8) ; port HIP.10  [project net HIP SCK]
SI: U6.16(Vl4) ; port HIP.7  [project net HIP SI]
SO: U6.14(Vl6) ; port HIP.8  [project net HIP SO]
NetC78_1: C78.1 R35.1
NetC79_1: C79.1 R36.1
NetC80_2: C80.2 U5.3(VMID) U5.15(CH1NI) U5.20(CH0NI)
NetC82_2: C82.2 R39.1 U5.9(OSCIN) XT1.1
NetC83_2: C83.2 R39.2 U5.10(OSCOUT) XT1.2
NetR35_2: R35.2 R37.1 U5.19(CH0IN)
NetR36_2: R36.2 R38.1 U5.16(CH1IN)
NetR37_2: R37.2 U5.18(CH0FB)
NetR38_2: R38.2 U5.17(CH1FB)
NetR40_2: R40.2 U5.14(~{TEST})
NetTP54_0: TP54.0 U5.7(INT/~{HOLD}) U6.3(Vcc2)
NetTP55_0: TP55.0 U5.12(SI) U6.5(Vcc4)
NetTP56_0: TP56.0 U5.11(SO) U6.7(Vcc6)
NetTP57_0: TP57.0 U5.13(SCK) U6.9(Vcc8)
NetTP58_0: TP58.0 U5.8(~{CS}) U6.13(Vcc7)

Not connected (* = marked no-connect by the designer): U6 2(Vl1) 4(Vl3) 6(Vl5) 15(Vcc5) 17(Vcc3) 19(Vcc1)

### Notes on the sheet
- Title
- Size:
- Date:
- A4
- Number:
- Time:
- Revision:
- Sheet
- of
- File:

### Library data of the parts
C78 C79 = Capasitor: CC0603KRX7R9BB332; Value: 3.3nF
C80 = Capasitor: CC0603KRX7R9BB223; Value: 22nF
C81 = Capasitor: CC0603KRX5R6BB475; Value: 4.7uF
C82 C83 = Capasitor: CC0603JRNPO9BN220; Value: 22pF
C84 C86 = Capasitor: CC0603KRX7R9BB104; Value: 100nF\50V
C85 = Capasitor: CL10A105KB8NNNC; Value: 1uF
R35-R38 = Resistor: RT0603BRD0733KL; Value: 33k 0.1%
R39 = Resistor: RC0603FR-071ML; Value: 1M
R40 = Resistor: RC0603FR-0710KL; Value: 10K
U5 = HIP9011: Engine Knock Signal Processor
U6 = ST2378E: 8-bit dual supply 1.71 to 5.5 V level translator with I/O VCC ± 15 KV / ESD protection
XT1 = xtall: KX-13 6.0 MHz / Geyer

## Sheet AnalogIn.SchDoc
size A4; Organization: Altium Limited; Address1: L3, 12a Rodborough Rd; Address2: Frenchs Forest; Address3: NSW; Address4: Australia 2086
Used 9 times, as channels AC1, AC2, AC3, AC4, AC5, AC6, AC7, AC8, AC9. Parts and nets are listed once, with the designators drawn on the sheet.
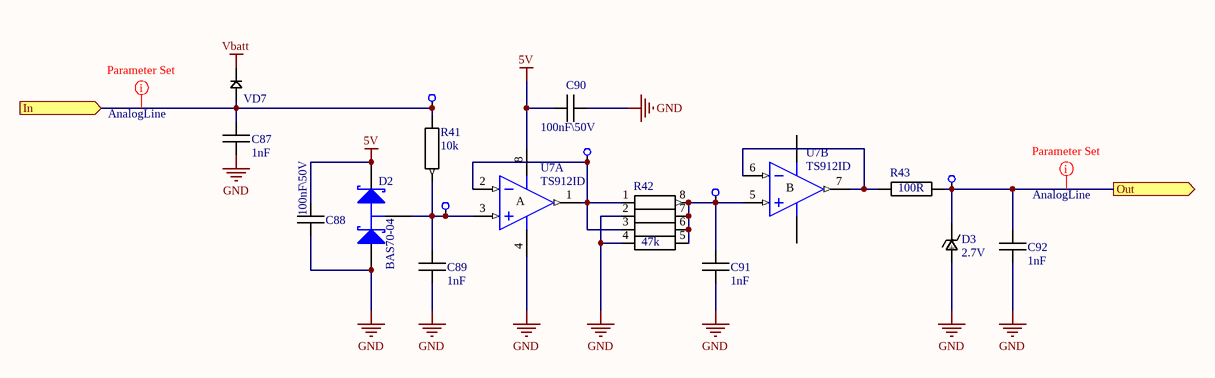
[diagram p10: AnalogIn.SchDoc]

### Parts
C87  1nF  [SMD 0603]
C88  100nF\50V  [SMD 0603]
C89  1nF  [SMD 0603]
C90  100nF\50V  [SMD 0603]
C91  1nF  [SMD 0603]
C92  1nF  [SMD 0603]
D2  BAS70-04  [SOT23_N]
D3  2.7V  [SOD123]
R41  10k  [SMD 0603]
R42  47k  [YC164]
R43  100R  [SMD 0603]
TP59  TestPoint  [TESTPOINT]  (value not drawn)
TP60  TestPoint  [TESTPOINT]  (value not drawn)
TP61  TestPoint  [TESTPOINT]  (value not drawn)
TP62  TestPoint  [TESTPOINT]  (value not drawn)
TP63  TestPoint  [TESTPOINT]  (value not drawn)
U7  TS912ID  [SO8_N]  (parts A,B of 2)
VD7  Diode  [SOD323]  (value not drawn)

### Ports
In (in), Out (out)

### Nets
5V: C88.1 C90.2 D2.2(K) U7.8(V+)
GND: C87.1 C88.2 C89.1 C90.1 C91.1 C92.1 D2.1(A) D3.- R42.2 R42.4 U7.4(V-)
Vbatt: VD7.1
In: C87.2 R41.1 TP59.0 VD7.0 ; port In
Out: C92.2 D3.+ R43.2 TP63.0 ; port Out
NetC89_2: C89.2 D2.3(C) R41.2 TP60.0 U7.3(IN+)
NetC91_2: C91.2 R42.5 R42.6 R42.7 R42.8 TP62.0 U7.5(IN+)
NetR42_1: R42.1 R42.3 TP61.0 U7.1(OUT) U7.2(IN-)
NetR43_1: R43.1 U7.6(IN-) U7.7(OUT)

Not connected (* = marked no-connect by the designer): U7 14(V-) 18(V+)

### Channels
AC1: designators end in _AC1; ports In=HIP sensor Out=HIP in
AC2: designators end in _AC2; ports In=TPS sensor Out=TPS
AC3: designators end in _AC3; ports In=NetC87_AC3_2 Out=MainVoltage
AC4: designators end in _AC4; ports In=MAF sensor Out=MAF
AC5: designators end in _AC5; ports In=MAP sensor Out=MAP
AC6: designators end in _AC6; ports In=Coolant Temp sensor Out=CoolantT
AC7: designators end in _AC7; ports In=Air Temp sensor Out=AirT
AC8: designators end in _AC8; ports In=NetC87_AC8_2 Out=Lambda1
AC9: designators end in _AC9; ports In=NetC87_AC9_2 Out=Lambda2

### Layout directives
net class AnalogLine: HIP in, HIP sensor

### Notes on the sheet
- Title
- Size:
- Date:
- A4
- Number:
- Time:
- Revision:
- Sheet
- of
- File:
- (in symbol TS912ID, part A) A
- (in symbol TS912ID, part B) B

### Library data of the parts
C87 C89 C91 C92 = Capasitor: CC0603KRX7R9BB102; Value: 1nF
C88 C90 = Capasitor: CC0603KRX7R9BB104; Value: 100nF\50V
D2 = BAS70-04: Schottky Barrier Double Diode; Published: 17-Sep-2003; LatestRevisionDate: 12-Dec-2006; LatestRevisionNote: IPC-7351 Footprint Added.; DatasheetVersion: 11-Oct-2001; PackageVersion: May-1999; PackageReference: SOT23; Publisher: Altium Limited; PackageDescription: 3-Pin SOT-23 Package 0.95 mm Pitch, 2.3 mm Lead Span; ComponentLink1Description: Manufacturer Link; ComponentLink1URL: http://www.semiconductors.philips.com/; ComponentLink2Description: Datasheet; ComponentLink2URL: http://www.semiconductors.philips.com/acrobat/datasheets/BAS70_SERIES_6.pdf
D3 = Zener: MMSZ2V7T1G; pin to pad: +>1 ->0; value: 2.7V
R41 = Resistor: RC0603FR-0710KL; Value: 10k
R42 = YC164: YC164-JR-0747KL; value: 47k
R43 = Resistor: RC0603FR-07100RL; Value: 100R
U7 = TS912ID: Rail-to-Rail CMOS Dual Operational Amplifier; Published: 24-Aug-2001; LatestRevisionDate: 13-Apr-2006; LatestRevisionNote: IPC-7351 Footprint Added.; DatasheetVersion: Apr-1999; PackageVersion: Dec-2002; PackageReference: SO8; Publisher: Altium Limited; PackageDescription: 8-Pin Small Outline Integrated Circuit 1.27 mm Pitch; Code_JEDEC: MS-012-AA; Code_IPC: SOIC127P600-8; ComponentLink1Description: Manufacturer Link; ComponentLink1URL: http://www.st.com/; ComponentLink2Description: Datasheet; ComponentLink2URL: http://www.st.com/stonline/products/literature/ds/2325/ts912.pdf
VD7 = Diode: PMEG2020EJ.115; pin to pad: 0>2

## Sheet Convert12to5.SchDoc
size A4; Organization: Altium Limited; Address1: L3, 12a Rodborough Rd; Address2: Frenchs Forest; Address3: NSW; Address4: Australia 2086
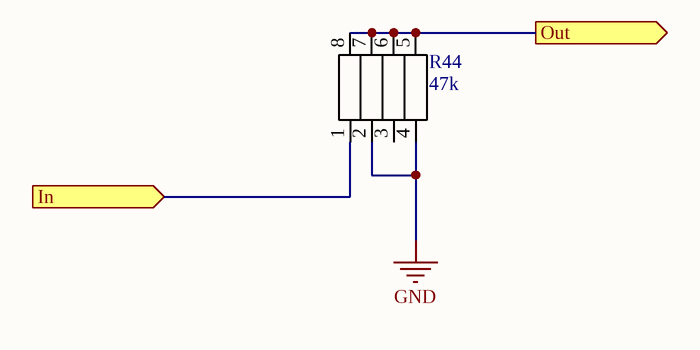
[diagram p11: Convert12to5.SchDoc]

### Parts
R44  47k  [YC164]

### Ports
In (in), Out (out)

### Nets
GND: R44.2 R44.4
Vmain: R44.1 ; port In
NetC87_AC3_2: R44.5 R44.6 R44.7 R44.8 ; port Out

Not connected (* = marked no-connect by the designer): R44 3

### Notes on the sheet
- Title
- Size:
- Date:
- A4
- Number:
- Time:
- Revision:
- Sheet
- of
- File:

### Library data of the parts
R44 = YC164: YC164-JR-0747KL; value: 47k

## Sheet LambdaIn.SchDoc
size A4; Organization: Altium Limited; Address1: L3, 12a Rodborough Rd; Address2: Frenchs Forest; Address3: NSW; Address4: Australia 2086
Used 2 times, as channels LIN1, LIN2. Parts and nets are listed once, with the designators drawn on the sheet.
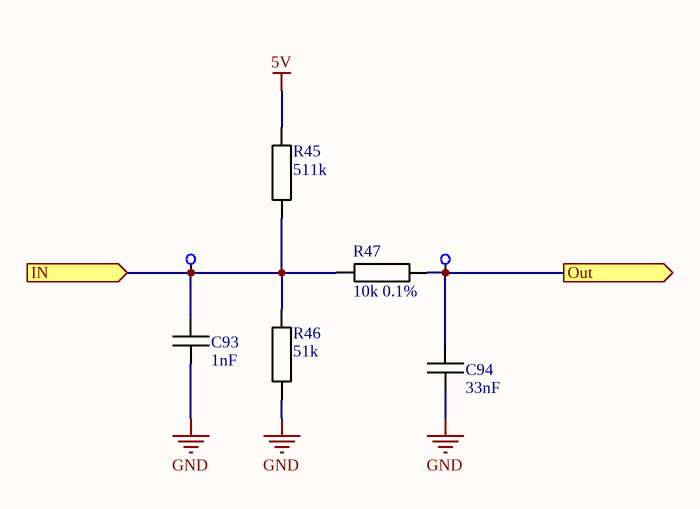
[diagram p12: LambdaIn.SchDoc]

### Parts
C93  1nF  [SMD 0603]
C94  33nF  [SMD 0603]
R45  511k  [SMD 0603]
R46  51k  [SMD 0603]
R47  10k 0.1%  [SMD 0603]
TP64  TestPoint  [TESTPOINT]  (value not drawn)
TP65  TestPoint  [TESTPOINT]  (value not drawn)

### Ports
IN (in), Out (out)

### Nets
5V: R45.1
GND: C93.1 C94.2 R46.2
IN: C93.2 R45.2 R46.1 R47.1 TP64.0 ; port IN
Out: C94.1 R47.2 TP65.0 ; port Out

### Channels
LIN1: designators end in _LIN1; ports IN=Lambda sensor Out=NetC87_AC8_2
LIN2: designators end in _LIN2; ports IN=Lambda sensor 2 Out=NetC87_AC9_2

### Notes on the sheet
- Title
- Size:
- Date:
- A4
- Number:
- Time:
- Revision:
- Sheet
- of
- File:

### Library data of the parts
C93 = Capasitor: CC0603KRX7R9BB102; Value: 1nF
C94 = Capasitor: CC0603JRX7R7BB333; Value: 33nF
R45 = Resistor: RC0603FR-07511KL; Value: 511k
R46 = Resistor: RC0603FR-0751KL; Value: 51k
R47 = Resistor: RT0603BRD0710KL; Value: 10k 0.1%

## Sheet TaxoOut.SchDoc
size A4; Organization: Altium Limited; Address1: L3, 12a Rodborough Rd; Address2: Frenchs Forest; Address3: NSW; Address4: Australia 2086
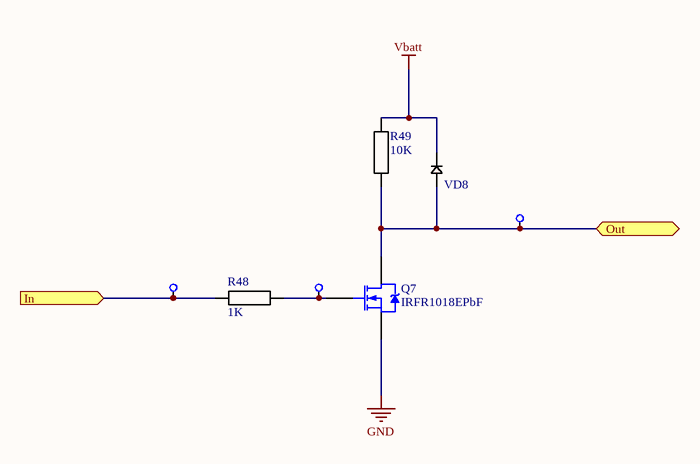
[diagram p13: TaxoOut.SchDoc]

### Parts
Q7  IRFR1018EPbF  [DPAK228P991X238-3M]
R48  1K  [SMD 0603]
R49  10K  [SMD 0603]
TP66  TestPoint  [TESTPOINT]  (value not drawn)
TP67  TestPoint  [TESTPOINT]  (value not drawn)
TP68  TestPoint  [TESTPOINT]  (value not drawn)
VD8  Diode  [DO-214AA]  (value not drawn)

### Ports
In (in), Out (bidir)

### Nets
GND: Q7.3(S)
Vbatt: R49.2 VD8.1
Taxo: Q7.4(D) R49.1 TP68.0 VD8.0 ; port Out
TaxoOut: R48.2 TP66.0 ; port In
NetQ7_1: Q7.1(G) R48.1 TP67.0

### Notes on the sheet
- Title
- Size:
- Date:
- A4
- Number:
- Time:
- Revision:
- Sheet
- of
- File:

### Library data of the parts
Q7 = IRFR1018EPbF: HEXFET Power MOSFET; ComponentLink1Description: datasheet; ComponentLink1URL: https://data.electronshik.ru/z/Datasheet/I/IRFR1018EPBF.pdf
R48 = Resistor: RC0603FR-071KL; Value: 1K
R49 = Resistor: RC0603FR-0710KL; Value: 10K
VD8 = Diode: as VD3 on sheet PowerSup; ComponentLink1Description: Datashit; ComponentLink1URL: https://www.st.com/resource/en/datasheet/stth4r02.pdf

## Sheet CPU_A.SchDoc
size A3; Organization: Altium Limited; Address1: L3, 12a Rodborough Rd; Address2: Frenchs Forest; Address3: NSW; Address4: Australia 2086
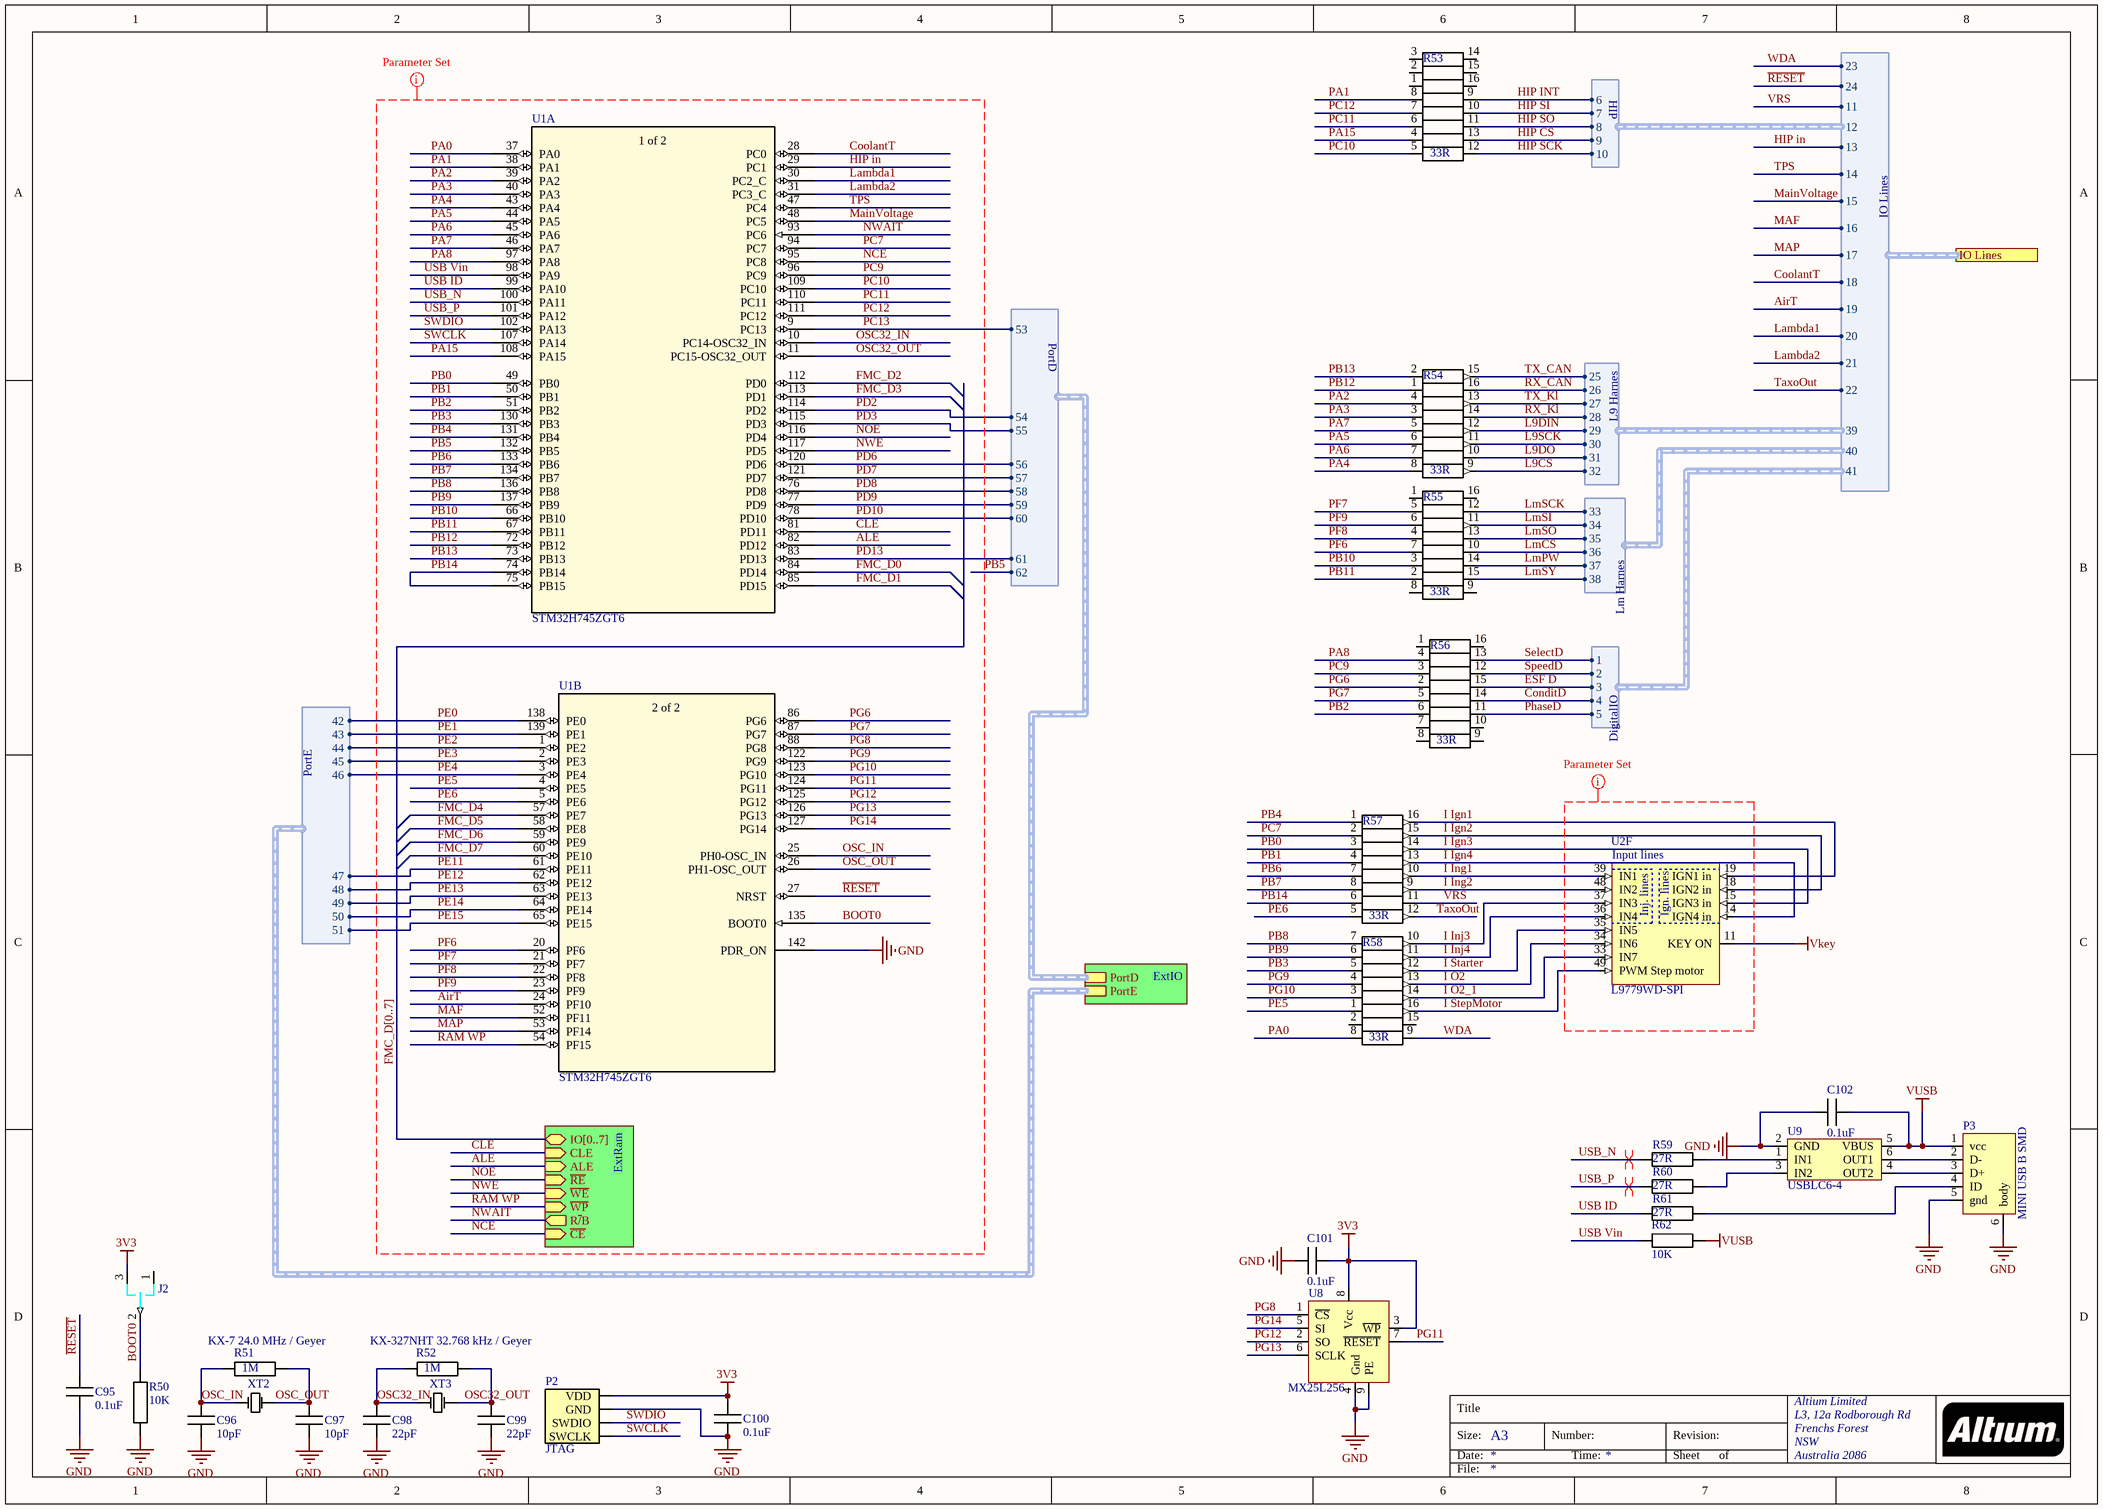
[diagram p14: CPU_A.SchDoc]

### Parts
C95  0.1uF  [SMD 0603]
C96  10pF  [SMD 0603]
C97  10pF  [SMD 0603]
C98  22pF  [SMD 0603]
C99  22pF  [SMD 0603]
C100  0.1uF  [SMD 0603]
C101  0.1uF  [SMD 0603]
C102  0.1uF  [SMD 0603]
J2  JUMPER SWITCH  [JMP3]  (value not drawn)
P2  JTAG  [HEADER 1x4]
P3  MINI USB B SMD  [MINI USB B SMD]
R50  10K  [SMD 0603]
R51  1M  [SMD 0603]
R52  1M  [SMD 0603]
R53  33R  [YC248]
R54  33R  [YC248]
R55  33R  [YC248]
R56  33R  [YC248]
R57  33R  [YC248]
R58  33R  [YC248]
R59  27R  [SMD 0603]
R60  27R  [SMD 0603]
R61  27R  [SMD 0603]
R62  10K  [SMD 0603]
U1  STM32H745ZGT6  [LQFP-144]  (parts A,B of 3)
U2  L9779WD-SPI  [HiQUAD-64]  (part F of 6)
U8  MX25L256  [WSON 8L]
U9  USBLC6-4  [SOT23-6]
XT2  KX-7 24.0 MHz / Geyer  [KX-7]
XT3  KX-327NHT 32.768 kHz / Geyer  [KX–327NHT]

### Sub-sheets
ExtIO = ExternalIO.SchDoc: PortD (harness PortD), PortE (harness PortE)
ExtRam = ExternalRAM.SchDoc: ~{RE} (in), ALE (in), ~{WE} (in), ~{WP} (in), CLE (in), R~{/}B (out), IO[0..7] (bidir), ~{CE} (in)

### Ports
IO Lines (harness IO Lines)

### Harnesses
IO Lines: 11, 12, 13, 14, 15, 16, 17, 18, 19, 20, 21, 22, 23, 24, 39, 40, 41
HIP: 6, 7, 8, 9, 10
L9 Harnes: 25, 26, 27, 28, 29, 30, 31, 32
Lm Harnes: 33, 34, 35, 36, 37, 38
DigitalIO: 1, 2, 3, 4, 5
PortE: 42, 43, 44, 45, 46, 47, 48, 49, 50, 51
PortD: 53, 54, 55, 56, 57, 58, 59, 60, 61, 62

### Nets
3V3: C100.2 C101.1 J2.3 P2.1(VDD) U8.3(~{WP}) U8.8(Vcc)
GND: C95.2 C96.2 C97.2 C98.2 C99.2 C100.1 C101.2 C102.2 P2.2(GND) P3.5(gnd) P3.6(body) R50.2 U1.142(PDR_ON) U8.4(Gnd) U8.9(PE) U9.2(GND) XT2.3 XT3.3
Vkey: U2.11(KEY_ON)
VUSB: C102.1 P3.1(vcc) R62.1 U9.5(VBUS)
~{HIP CS}: R53.13 ; harness HIP.9  [project net ~{CS}]
~{L9CS}: R54.9 ; harness L9 Harnes.32
~{LmCS}: R55.10 ; harness Lm Harnes.36
~{RESET}: C95.1 U1.27(NRST) ; port IO Lines.24
AirT: U1.24(PF10) ; port IO Lines.19
ALE: U1.82(PD12) ; sheet ExtRam/ALE
BOOT0: J2.2 R50.1 U1.135(BOOT0)
CLE: U1.81(PD11) ; sheet ExtRam/CLE
ConditD: R56.14 ; harness DigitalIO.4
CoolantT: U1.28(PC0) ; port IO Lines.18
ESF D: R56.15 ; harness DigitalIO.3
FMC_D0: U1.84(PD14)
FMC_D1: U1.85(PD15)
FMC_D2: U1.112(PD0)
FMC_D3: U1.113(PD1)
FMC_D4: U1.57(PE7)
FMC_D5: U1.58(PE8)
FMC_D6: U1.59(PE9)
FMC_D7: U1.60(PE10)
HIP in: U1.29(PC1) ; port IO Lines.13
HIP INT: R53.9 ; harness HIP.6
HIP SCK: R53.12 ; harness HIP.10
HIP SI: R53.10 ; harness HIP.7
HIP SO: R53.11 ; harness HIP.8
I Ign1: R57.16 U2.19(IGN1_in)
I Ign2: R57.15 U2.18(IGN2_in)
I Ign3: R57.14 U2.15(IGN3_in)
I Ign4: R57.13 U2.14(IGN4_in)
I Ing1: R57.10 U2.39(IN1)
I Ing2: R57.9 U2.48(IN2)
I Inj3: R58.10 U2.37(IN3)
I Inj4: R58.11 U2.36(IN4)
I O2: R58.13 U2.34(IN6)
I O2_1: R58.14 U2.33(IN7)
I Starter: R58.12 U2.35(IN5)
I StepMotor: R58.16 U2.49(PWM_Step_motor)
L9DIN: R54.12 ; harness L9 Harnes.29
L9DO: R54.10 ; harness L9 Harnes.31
L9SCK: R54.11 ; harness L9 Harnes.30
Lambda1: U1.30(PC2_C) ; port IO Lines.20
Lambda2: U1.31(PC3_C) ; port IO Lines.21
LmPW: R55.14 ; harness Lm Harnes.37
LmSCK: R55.12 ; harness Lm Harnes.33
LmSI: R55.11 ; harness Lm Harnes.34
LmSO: R55.13 ; harness Lm Harnes.35
LmSY: R55.15 ; harness Lm Harnes.38
MAF: U1.52(PF11) ; port IO Lines.16
MainVoltage: U1.48(PC5) ; port IO Lines.15
MAP: U1.53(PF14) ; port IO Lines.17
NCE: U1.95(PC8) ; sheet ExtRam/~{CE}
NOE: U1.116(PD4) ; sheet ExtRam/~{RE}
NWAIT: U1.93(PC6) ; sheet ExtRam/R~{/}B
NWE: U1.117(PD5) ; sheet ExtRam/~{WE}
OSC32_IN: C98.1 R52.1 U1.10(PC14-OSC32_IN) XT3.1
OSC32_OUT: C99.1 R52.2 U1.11(PC15-OSC32_OUT) XT3.2
OSC_IN: C96.1 R51.1 U1.25(PH0-OSC_IN) XT2.1
OSC_OUT: C97.1 R51.2 U1.26(PH1-OSC_OUT) XT2.2
PA0: R58.8 U1.37(PA0)
PA1: R53.8 U1.38(PA1)
PA2: R54.4 U1.39(PA2)
PA3: R54.3 U1.40(PA3)
PA4: R54.8 U1.43(PA4)
PA5: R54.6 U1.44(PA5)
PA6: R54.7 U1.45(PA6)
PA7: R54.5 U1.46(PA7)
PA8: R56.4 U1.97(PA8)
PA15: R53.4 U1.108(PA15)
PB0: R57.3 U1.49(PB0)
PB1: R57.4 U1.50(PB1)
PB2: R56.6 U1.51(PB2)
PB3: R58.5 U1.130(PB3)
PB4: R57.1 U1.131(PB4)
PB5: U1.132(PB5) ; sheet ExtIO/PortD.62
PB6: R57.7 U1.133(PB6)
PB7: R57.8 U1.134(PB7)
PB8: R58.7 U1.136(PB8)
PB9: R58.6 U1.137(PB9)
PB10: R55.3 U1.66(PB10)
PB11: R55.2 U1.67(PB11)
PB12: R54.1 U1.72(PB12)
PB13: R54.2 U1.73(PB13)
PB14: R57.6 U1.74(PB14) U1.75(PB15)
PC7: R57.2 U1.94(PC7)
PC9: R56.3 U1.96(PC9)
PC10: R53.5 U1.109(PC10)
PC11: R53.6 U1.110(PC11)
PC12: R53.7 U1.111(PC12)
PC13: U1.9(PC13) ; sheet ExtIO/PortD.53
PD2: U1.114(PD2) ; sheet ExtIO/PortD.54
PD3: U1.115(PD3) ; sheet ExtIO/PortD.55
PD6: U1.120(PD6) ; sheet ExtIO/PortD.56
PD7: U1.121(PD7) ; sheet ExtIO/PortD.57
PD8: U1.76(PD8) ; sheet ExtIO/PortD.58
PD9: U1.77(PD9) ; sheet ExtIO/PortD.59
PD10: U1.78(PD10) ; sheet ExtIO/PortD.60
PD13: U1.83(PD13) ; sheet ExtIO/PortD.61
PE0: U1.138(PE0) ; sheet ExtIO/PortE.42
PE1: U1.139(PE1) ; sheet ExtIO/PortE.43
PE2: U1.1(PE2) ; sheet ExtIO/PortE.44
PE3: U1.2(PE3) ; sheet ExtIO/PortE.45
PE4: U1.3(PE4) ; sheet ExtIO/PortE.46
PE5: R58.1 U1.4(PE5)
PE6: R57.5 U1.5(PE6)
PE11: U1.61(PE11) ; sheet ExtIO/PortE.47
PE12: U1.62(PE12) ; sheet ExtIO/PortE.48
PE13: U1.63(PE13) ; sheet ExtIO/PortE.49
PE14: U1.64(PE14) ; sheet ExtIO/PortE.50
PE15: U1.65(PE15) ; sheet ExtIO/PortE.51
PF6: R55.7 U1.20(PF6)
PF7: R55.5 U1.21(PF7)
PF8: R55.4 U1.22(PF8)
PF9: R55.6 U1.23(PF9)
PG6: R56.2 U1.86(PG6)
PG7: R56.5 U1.87(PG7)
PG8: U1.88(PG8) U8.1(~{CS})
PG9: R58.4 U1.122(PG9)
PG10: R58.3 U1.123(PG10)
PG11: U1.124(PG11) U8.7(~{RESET})
PG12: U1.125(PG12) U8.2(SO)
PG13: U1.126(PG13) U8.6(SCLK)
PG14: U1.127(PG14) U8.5(SI)
PhaseD: R56.11 ; harness DigitalIO.5
RAM WP: U1.54(PF15) ; sheet ExtRam/~{WP}
RX_CAN: R54.16 ; harness L9 Harnes.26
RX_Kl: R54.14 ; harness L9 Harnes.28
SelectD: R56.13 ; harness DigitalIO.1
SpeedD: R56.12 ; harness DigitalIO.2
SWCLK: P2.4(SWCLK) U1.107(PA14)
SWDIO: P2.3(SWDIO) U1.102(PA13)
TaxoOut: R57.12 ; port IO Lines.22
TPS: U1.47(PC4) ; port IO Lines.14
TX_CAN: R54.15 ; harness L9 Harnes.25
TX_Kl: R54.13 ; harness L9 Harnes.27
USB ID: R61.1 U1.99(PA10)
USB Vin: R62.2 U1.98(PA9)
USB_N: R59.1 U1.100(PA11)
USB_P: R60.1 U1.101(PA12)
VRS: R57.11 ; port IO Lines.11
WDA: R58.9 ; port IO Lines.23
NetP3_2: P3.2(D-) U9.6(OUT1)
NetP3_3: P3.3(D+) U9.4(OUT2)
NetP3_4: P3.4(ID) R61.2
NetR59_2: R59.2 U9.1(IN1)
NetR60_2: R60.2 U9.3(IN2)

Not connected (* = marked no-connect by the designer): J2 1; R53 1 2 3 14 15 16; R55 1 8 9 16; R56 1 7 8 9 10 16; R58 2 15

### Buses and harness runs
bus FMC_D[0..7] = sheet ExtRam/IO[0..7]

### Layout directives
differential pair: USB_N, USB_P
net class L970 line: (no net found under the mark)
net class CPU Lines: AirT, ALE, BOOT0, CLE, CoolantT, FMC_D0, FMC_D1, FMC_D2, FMC_D3, FMC_D4, FMC_D5, FMC_D6, FMC_D7, FMC_D[0..7], GND, HIP in, Lambda1, Lambda2, MAF, MainVoltage, MAP, NCE, NOE, NWAIT, NWE, OSC32_IN, OSC32_OUT, OSC_IN, OSC_OUT, PA0, PA1, PA2, PA3, PA4, PA5, PA6, PA7, PA8, PA15, PB0, PB1, PB2, PB3, PB4, PB5, PB6, PB7, PB8, PB9, PB10, PB11, PB12, PB13, PB14, PC7, PC9, PC10, PC11, PC12, PC13, PD2, PD3, PD6, PD7, PD8, PD9, PD10, PD13, PE0, PE1, PE2, PE3, PE4, PE5, PE6, PE11, PE12, PE13, PE14, PE15, PF6, PF7, PF8, PF9, PG6, PG7, PG8, PG9, PG10, PG11, PG12, PG13, PG14, RAM WP, SWCLK, SWDIO, TPS, USB ID, USB Vin, USB_N, USB_P, ~{RESET}

### Notes on the sheet
- Title
- Size:
- Date:
- A3
- Number:
- Time:
- Revision:
- Sheet
- of
- File:
- (in symbol L9779WD-SPI, part F) Input lines; Inj. lines; Ign. lines
- (in symbol STM32H745ZGT6, part A) 1 of 2
- (in symbol STM32H745ZGT6, part B) 2 of 2

### Library data of the parts
C95-C102 = Capasitor
  C95 C100-C102: Value: 0.1uF
  C96 C97: Value: 10pF
  C98 C99: Value: 22pF
P2 = JTAG-STM-SW
R50 R62 = Resistor: RC0603FR-0710KL; Value: 10K
R51 R52 = Resistor: RC0603FR-071ML; Value: 1M
R53-R58 = YC248: YC248-JR-0733RL; value: 33R
R59-R61 = Resistor: RC0603FR-0727RL; Value: 27R
U1 = STM32H745ZGT6: as U1 on sheet PowerSup; Manufacturer_Part_Number: STM32H745ZGT6; Copyright: Copyright (C) 2018 Accelerated Designs. All rights reserved; RefDes: RefDes; Type: DEV
U2 = L9779WD-SPI: as U2 on sheet Connector
U8 = MX25L256: MX25L25635FZ2I-10G
XT2 XT3 = xtall

## Sheet ExternalRAM.SchDoc
size A4; Organization: Altium Limited; Address1: L3, 12a Rodborough Rd; Address2: Frenchs Forest; Address3: NSW; Address4: Australia 2086
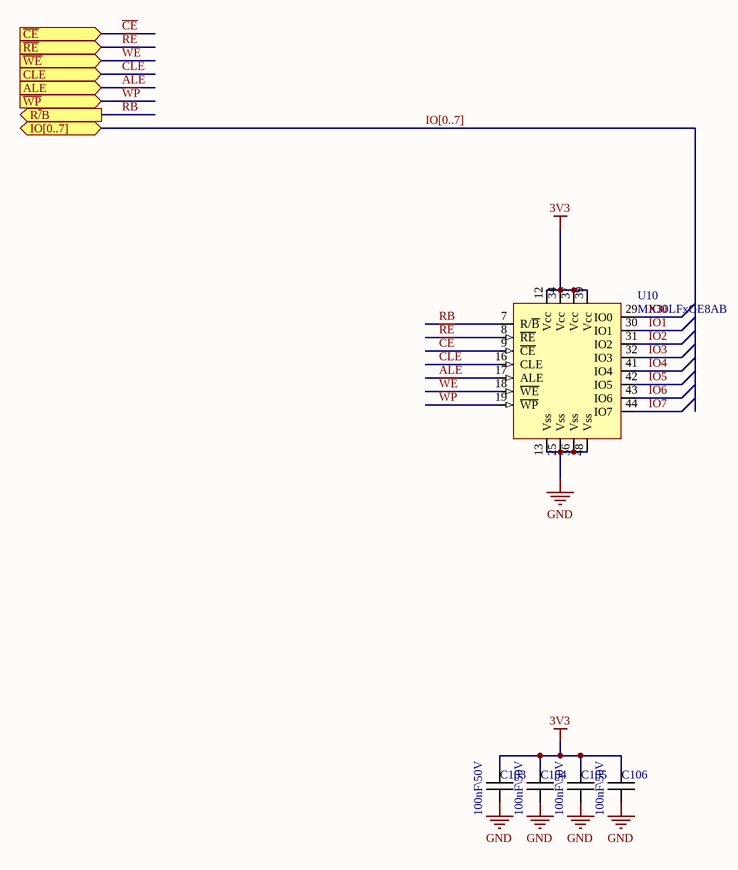
[diagram p15: ExternalRAM.SchDoc]

### Parts
C103  100nF\50V  [SMD 0603]
C104  100nF\50V  [SMD 0603]
C105  100nF\50V  [SMD 0603]
C106  100nF\50V  [SMD 0603]
U10  MX30LFxGE8AB  [TSSOP50P2000X120-48N]

### Ports
ALE (in), CLE (in), IO[0..7] (bidir), R~{/}B (out), ~{CE} (in), ~{RE} (in), ~{WE} (in), ~{WP} (in)

### Nets
3V3: C103.2 C104.2 C105.2 C106.2 U10.12(Vcc) U10.34(Vcc) U10.37(Vcc) U10.39(Vcc)
GND: C103.1 C104.1 C105.1 C106.1 U10.13(Vss) U10.25(Vss) U10.36(Vss) U10.48(Vss)
~{CE}: U10.9(~{CE}) ; port ~{CE}  [project net NCE]
~{RE}: U10.8(~{RE}) ; port ~{RE}  [project net NOE]
~{WE}: U10.18(~{WE}) ; port ~{WE}  [project net NWE]
~{WP}: U10.19(~{WP}) ; port ~{WP}  [project net RAM WP]
ALE: U10.17(ALE) ; port ALE
CLE: U10.16(CLE) ; port CLE
IO0: U10.29(IO0)  [project net FMC_D0]
IO1: U10.30(IO1)  [project net FMC_D1]
IO2: U10.31(IO2)  [project net FMC_D2]
IO3: U10.32(IO3)  [project net FMC_D3]
IO4: U10.41(IO4)  [project net FMC_D4]
IO5: U10.42(IO5)  [project net FMC_D5]
IO6: U10.43(IO6)  [project net FMC_D6]
IO7: U10.44(IO7)  [project net FMC_D7]
RB: U10.7(R/~{B}) ; port R~{/}B  [project net NWAIT]

### Buses and harness runs
bus IO[0..7] = port IO[0..7]

### Notes on the sheet
- Title
- Size:
- Date:
- A4
- Number:
- Time:
- Revision:
- Sheet
- of
- File:

### Library data of the parts
C103-C106 = Capasitor: CC0603KRX7R9BB104; Value: 100nF\50V
U10 = MX30LFxGE8AB: 1G/2G/4G-bit NAND Flash Memory  (ECC-Free); ComponentLink1Description: Datasheet; ComponentLink1URL: https://www.mxic.com.tw/Lists/Datasheet/Attachments/6854/MX30LF4GE8AB,%203V,%204Gb,%20v1.3.pdf